# EAGLE design beagle_boy (EAGLE 5.10)

## Sheet 1 of 2
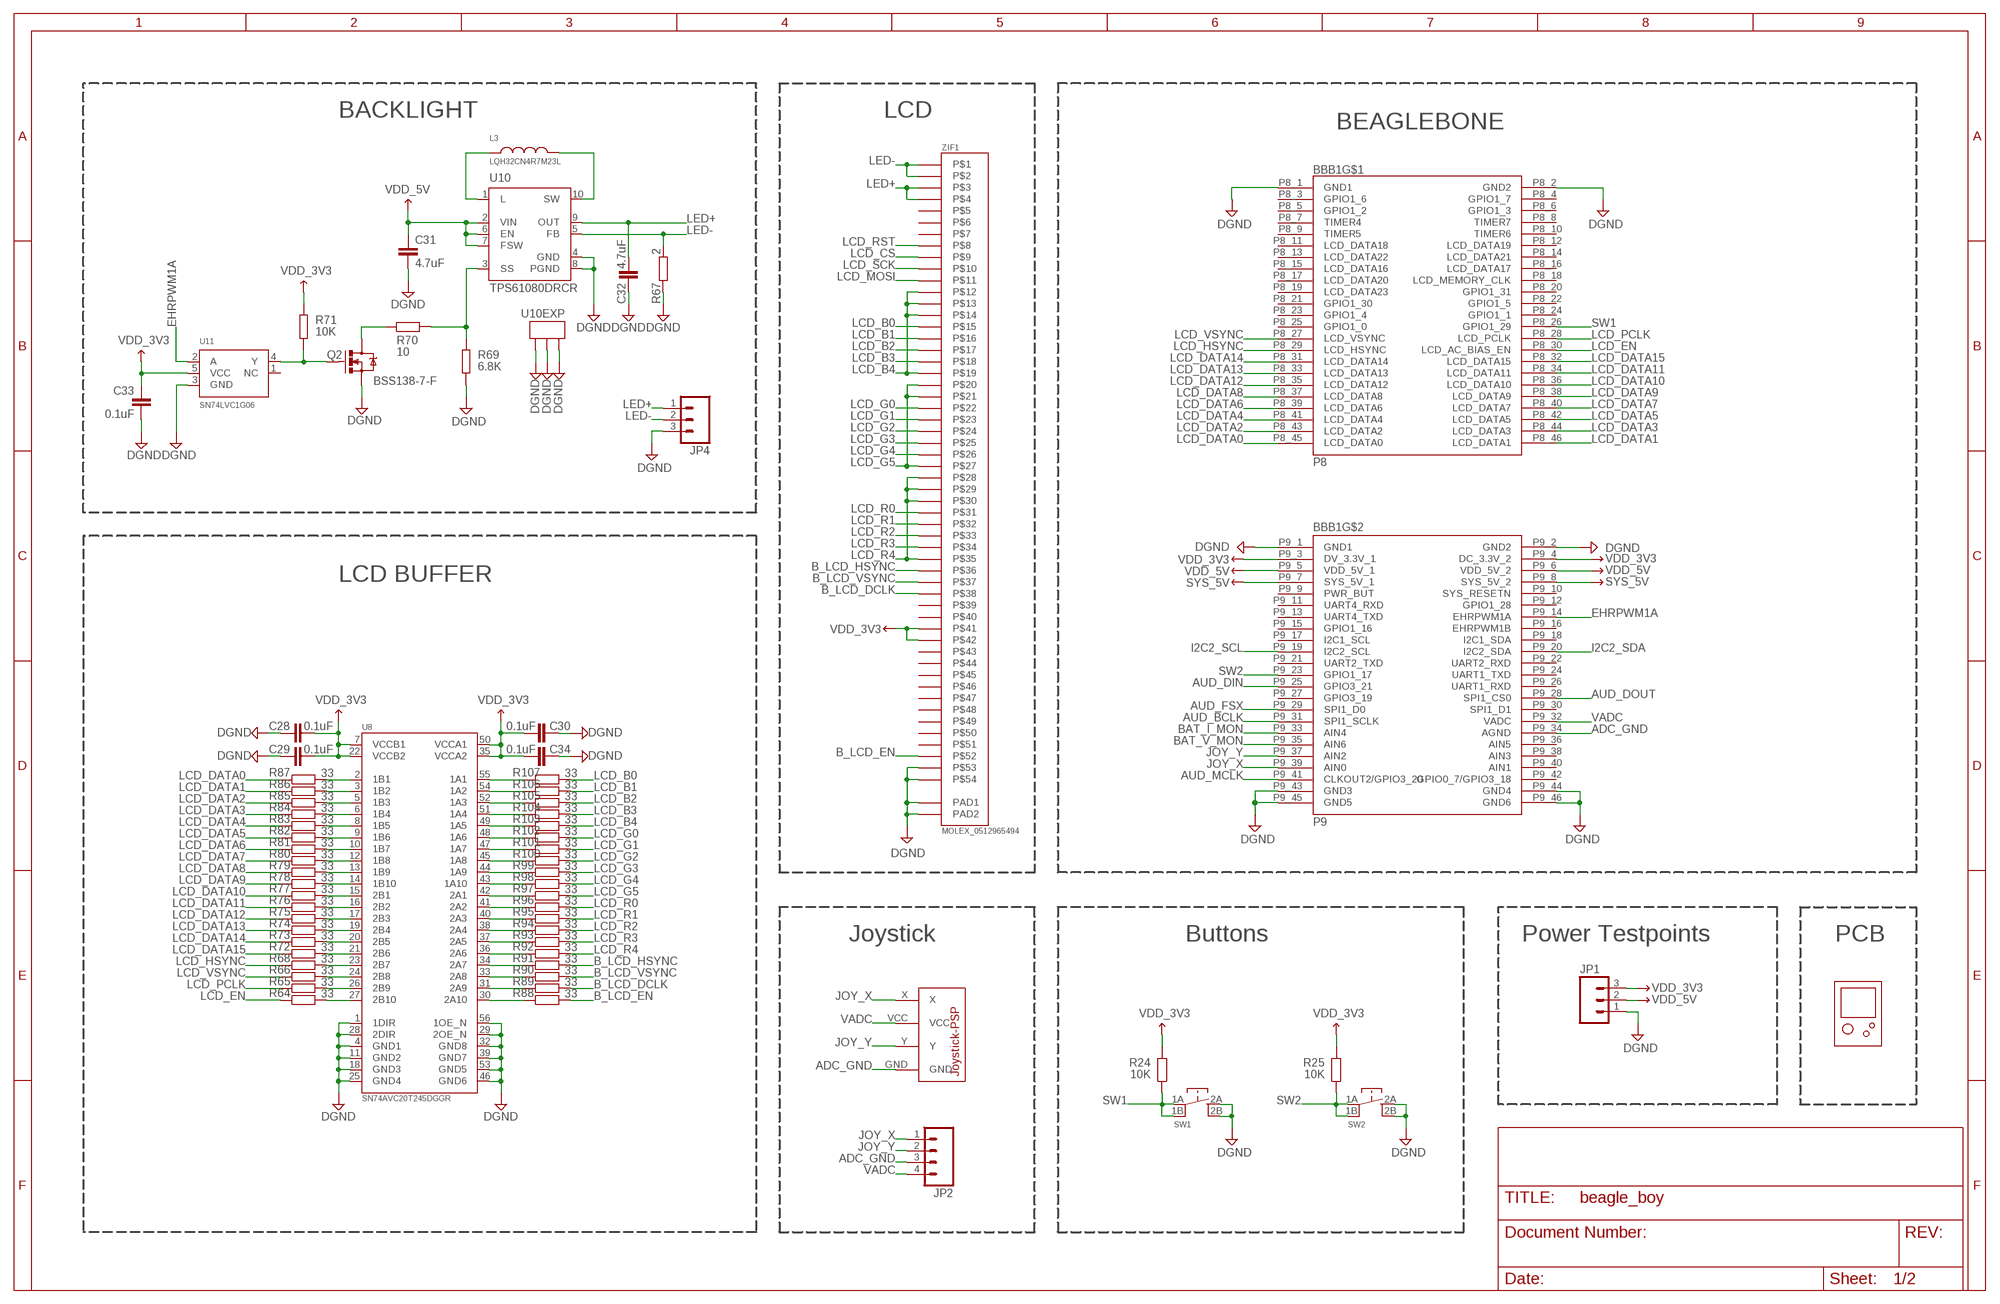
[diagram p0: schematic, sheet 1]

### Parts
BBB1  BEAGLEBONE_BLACK  [BEAGLEBOARD_BLACK]
BOARD  BEAGLE_BOY  [BEAGLE_BOY]
C28  0.1uF  C-EUC0603  [C0603]
C29  0.1uF  C-EUC0603  [C0603]
C30  0.1uF  C-EUC0603  [C0603]
C31  4.7uF  C-EUC0603  [C0603]
C32  4.7uF  C-EUC0603  [C0603]
C33  0.1uF  C-EUC0603  [C0603]
C34  0.1uF  C-EUC0603  [C0603]
JP1  M031X03_NO_SILK  [1X03_NO_SILK]
JP2  M041X04_NO_SILK  [1X04_NO_SILK]
JP4  M031X03_NO_SILK  [1X03_NO_SILK]
L3  LQH32CN4R7M23L  [LQH32C_23]
Q2  BSS138-7-F  MOSFET-NCHANNELSMD  [SOT23-3]
R24  10K  R-EU_R0603  [R0603]
R25  10K  R-EU_R0603  [R0603]
R64  33  R-EU_R0402  [R0402]
R65  33  R-EU_R0402  [R0402]
R66  33  R-EU_R0402  [R0402]
R67  2  R-EU_R0603  [R0603]
R68  33  R-EU_R0402  [R0402]
R69  6.8K  R-EU_R0603  [R0603]
R70  10  R-EU_R0603  [R0603]
R71  10K  R-EU_R0603  [R0603]
R72  33  R-EU_R0402  [R0402]
R73  33  R-EU_R0402  [R0402]
R74  33  R-EU_R0402  [R0402]
R75  33  R-EU_R0402  [R0402]
R76  33  R-EU_R0402  [R0402]
R77  33  R-EU_R0402  [R0402]
R78  33  R-EU_R0402  [R0402]
R79  33  R-EU_R0402  [R0402]
R80  33  R-EU_R0402  [R0402]
R81  33  R-EU_R0402  [R0402]
R82  33  R-EU_R0402  [R0402]
R83  33  R-EU_R0402  [R0402]
R84  33  R-EU_R0402  [R0402]
R85  33  R-EU_R0402  [R0402]
R86  33  R-EU_R0402  [R0402]
R87  33  R-EU_R0402  [R0402]
R88  33  R-EU_R0402  [R0402]
R89  33  R-EU_R0402  [R0402]
R90  33  R-EU_R0402  [R0402]
R91  33  R-EU_R0402  [R0402]
R92  33  R-EU_R0402  [R0402]
R93  33  R-EU_R0402  [R0402]
R94  33  R-EU_R0402  [R0402]
R95  33  R-EU_R0402  [R0402]
R96  33  R-EU_R0402  [R0402]
R97  33  R-EU_R0402  [R0402]
R98  33  R-EU_R0402  [R0402]
R99  33  R-EU_R0402  [R0402]
R100  33  R-EU_R0402  [R0402]
R101  33  R-EU_R0402  [R0402]
R102  33  R-EU_R0402  [R0402]
R103  33  R-EU_R0402  [R0402]
R104  33  R-EU_R0402  [R0402]
R105  33  R-EU_R0402  [R0402]
R106  33  R-EU_R0402  [R0402]
R107  33  R-EU_R0402  [R0402]
SW1  KSA0M  [KSA0M]
SW2  KSA0M  [KSA0M]
U8  SN74AVC20T245DGGR  [56-TSSOP]
U10  TPS61080DRCR  TPS61080  [S-PDSO-N10]
U11  SN74LVC1G06  SN74LVC1G06DBVR  [SOT23-5]
U$1  JOYSTICK-PSP1000  [JOYSTICK-PSP1000]
ZIF1  MOLEX_0512965494  [51296-5494]

### Nets
ADC_GND: BBB1.P9_34(AGND) JP2.3 U$1.GND
AUD_BCLK: BBB1.P9_31(SPI1_SCLK) ; also sheet 2
AUD_DIN: BBB1.P9_25(GPIO3_21) ; also sheet 2
AUD_DOUT: BBB1.P9_28(SPI1_CS0) ; also sheet 2
AUD_FSX: BBB1.P9_29(SPI1_D0) ; also sheet 2
AUD_MCLK: BBB1.P9_41(CLKOUT2/GPIO3_20) ; also sheet 2
B_LCD_DCLK: R89.2 ZIF1.P$38
B_LCD_EN: R88.2 ZIF1.P$52
B_LCD_HSYNC: R91.2 ZIF1.P$36
B_LCD_VSYNC: R90.2 ZIF1.P$37
BAT_I_MON: BBB1.P9_33(AIN4) ; also sheet 2
BAT_V_MON: BBB1.P9_35(AIN6) ; also sheet 2
DGND: BBB1.P8_1(GND1) BBB1.P8_2(GND2) BBB1.P9_1(GND1) BBB1.P9_2(GND2) BBB1.P9_43(GND3) BBB1.P9_44(GND4) BBB1.P9_45(GND5) BBB1.P9_46(GND6) C28.1 C29.1 C30.1 C31.2 C32.2 C33.2 C34.1 JP1.1 JP4.3 Q2.2(S) R67.1 R69.1 SW1.2A SW1.2B SW2.2A SW2.2B U8.1(1DIR) U8.4(GND1) U8.11(GND2) U8.18(GND3) U8.25(GND4) U8.28(2DIR) U8.29(2OE_N) U8.32(GND8) U8.39(GND7) U8.46(GND6) U8.53(GND5) U8.56(1OE_N) U10.4(GND) U10.8(PGND) U10.PP(EXP) U10.PP@1(EXP) U10.PP@2(EXP) U11.3(GND) ZIF1.P$53 ZIF1.P$54 ZIF1.PAD1 ZIF1.PAD2 ; also sheet 2
EHRPWM1A: BBB1.P9_14(EHRPWM1A) U11.2(A)
I2C2_SCL: BBB1.P9_19(I2C2_SCL) ; also sheet 2
I2C2_SDA: BBB1.P9_20(I2C2_SDA) ; also sheet 2
JOY_X: BBB1.P9_39(AIN0) JP2.1 U$1.X
JOY_Y: BBB1.P9_37(AIN2) JP2.2 U$1.Y
LCD_B0: R107.2 ZIF1.P$15
LCD_B1: R106.2 ZIF1.P$16
LCD_B2: R105.2 ZIF1.P$17
LCD_B3: R104.2 ZIF1.P$18
LCD_B4: R103.2 ZIF1.P$12 ZIF1.P$13 ZIF1.P$14 ZIF1.P$19
LCD_CS: ZIF1.P$9
LCD_DATA0: BBB1.P8_45(LCD_DATA0) R87.1
LCD_DATA1: BBB1.P8_46(LCD_DATA1) R86.1
LCD_DATA2: BBB1.P8_43(LCD_DATA2) R85.1
LCD_DATA3: BBB1.P8_44(LCD_DATA3) R84.1
LCD_DATA4: BBB1.P8_41(LCD_DATA4) R83.1
LCD_DATA5: BBB1.P8_42(LCD_DATA5) R82.1
LCD_DATA6: BBB1.P8_39(LCD_DATA6) R81.1
LCD_DATA7: BBB1.P8_40(LCD_DATA7) R80.1
LCD_DATA8: BBB1.P8_37(LCD_DATA8) R79.1
LCD_DATA9: BBB1.P8_38(LCD_DATA9) R78.1
LCD_DATA10: BBB1.P8_36(LCD_DATA10) R77.1
LCD_DATA11: BBB1.P8_34(LCD_DATA11) R76.1
LCD_DATA12: BBB1.P8_35(LCD_DATA12) R75.1
LCD_DATA13: BBB1.P8_33(LCD_DATA13) R74.1
LCD_DATA14: BBB1.P8_31(LCD_DATA14) R73.1
LCD_DATA15: BBB1.P8_32(LCD_DATA15) R72.1
LCD_EN: BBB1.P8_30(LCD_AC_BIAS_EN) R64.1
LCD_G0: R102.2 ZIF1.P$22
LCD_G1: R101.2 ZIF1.P$23
LCD_G2: R100.2 ZIF1.P$24
LCD_G3: R99.2 ZIF1.P$25
LCD_G4: R98.2 ZIF1.P$26
LCD_G5: R97.2 ZIF1.P$20 ZIF1.P$21 ZIF1.P$27
LCD_HSYNC: BBB1.P8_29(LCD_HSYNC) R68.1
LCD_MOSI: ZIF1.P$11
LCD_PCLK: BBB1.P8_28(LCD_PCLK) R65.1
LCD_R0: R96.2 ZIF1.P$31
LCD_R1: R95.2 ZIF1.P$32
LCD_R2: R94.2 ZIF1.P$33
LCD_R3: R93.2 ZIF1.P$34
LCD_R4: R92.2 ZIF1.P$28 ZIF1.P$29 ZIF1.P$30 ZIF1.P$35
LCD_RST: ZIF1.P$8
LCD_SCK: ZIF1.P$10
LCD_VSYNC: BBB1.P8_27(LCD_VSYNC) R66.1
LED+: C32.1 JP4.1 U10.9(OUT) ZIF1.P$3 ZIF1.P$4
LED-: JP4.2 R67.2 U10.5(FB) ZIF1.P$1 ZIF1.P$2
N$4: R64.2 U8.27(2B10)
N$17: R65.2 U8.26(2B9)
N$21: R66.2 U8.24(2B8)
N$29: R68.2 U8.23(2B7)
N$30: R72.2 U8.21(2B6)
N$31: R73.2 U8.20(2B5)
N$32: R74.2 U8.19(2B4)
N$33: R75.2 U8.17(2B3)
N$34: R76.2 U8.16(2B2)
N$35: R77.2 U8.15(2B1)
N$36: R107.1 U8.55(1A1)
N$37: R106.1 U8.54(1A2)
N$38: R105.1 U8.52(1A3)
N$39: R104.1 U8.51(1A4)
N$40: R103.1 U8.49(1A5)
N$41: R102.1 U8.48(1A6)
N$42: R94.1 U8.38(2A4)
N$43: R100.1 U8.45(1A8)
N$44: R99.1 U8.44(1A9)
N$45: R98.1 U8.43(1A10)
N$46: R101.1 U8.47(1A7)
N$103: R86.2 U8.3(1B2)
N$104: R85.2 U8.5(1B3)
N$105: R84.2 U8.6(1B4)
N$107: L3.P$1 U10.1(L)
N$108: L3.P$2 U10.10(SW)
N$109: R69.2 R70.2 U10.3(SS)
N$110: Q2.3(D) R70.1
N$111: Q2.1(G) R71.1 U11.4(Y)
N$117: R78.2 U8.14(1B10)
N$118: R79.2 U8.13(1B9)
N$119: R80.2 U8.12(1B8)
N$120: R81.2 U8.10(1B7)
N$121: R82.2 U8.9(1B6)
N$122: R83.2 U8.8(1B5)
N$126: R87.2 U8.2(1B1)
N$149: R90.1 U8.33(2A8)
N$151: R92.1 U8.36(2A6)
N$157: R97.1 U8.42(2A1)
N$158: R96.1 U8.41(2A2)
N$159: R95.1 U8.40(2A3)
N$161: R93.1 U8.37(2A5)
N$163: R91.1 U8.34(2A7)
N$165: R89.1 U8.31(2A9)
N$166: R88.1 U8.30(2A10)
SW1: BBB1.P8_26(GPIO1_29) R24.1 SW1.1A SW1.1B
SW2: BBB1.P9_23(GPIO1_17) R25.1 SW2.1A SW2.1B
SYS_5V: BBB1.P9_7(SYS_5V_1) BBB1.P9_8(SYS_5V_2)
VADC: BBB1.P9_32(VADC) JP2.4 U$1.VCC
VDD_3V3: BBB1.P9_3(DV_3.3V_1) BBB1.P9_4(DC_3.3V_2) C28.2 C29.2 C30.2 C33.1 C34.2 JP1.3 R24.2 R25.2 R71.2 U8.7(VCCB1) U8.22(VCCB2) U8.35(VCCA2) U8.50(VCCA1) U11.5(VCC) ZIF1.P$41 ZIF1.P$42 ; also sheet 2
VDD_5V: BBB1.P9_5(VDD_5V_1) BBB1.P9_6(VDD_5V_2) C31.1 JP1.2 U10.2(VIN) U10.6(EN) U10.7(FSW) ; also sheet 2
Unconnected: BBB1.P8_3(GPIO1_6) BBB1.P8_4(GPIO1_7) BBB1.P8_5(GPIO1_2) BBB1.P8_6(GPIO1_3) BBB1.P8_7(TIMER4) BBB1.P8_8(TIMER7) BBB1.P8_9(TIMER5) BBB1.P8_10(TIMER6) BBB1.P8_11(LCD_DATA18) BBB1.P8_12(LCD_DATA19) BBB1.P8_13(LCD_DATA22) BBB1.P8_14(LCD_DATA21) BBB1.P8_15(LCD_DATA16) BBB1.P8_16(LCD_DATA17) BBB1.P8_17(LCD_DATA20) BBB1.P8_18(LCD_MEMORY_CLK) BBB1.P8_19(LCD_DATA23) BBB1.P8_20(GPIO1_31) BBB1.P8_21(GPIO1_30) BBB1.P8_22(GPIO1_5) BBB1.P8_23(GPIO1_4) BBB1.P8_24(GPIO1_1) BBB1.P8_25(GPIO1_0) BBB1.P9_9(PWR_BUT) BBB1.P9_10(SYS_RESETN) BBB1.P9_11(UART4_RXD) BBB1.P9_12(GPIO1_28) BBB1.P9_13(UART4_TXD) BBB1.P9_15(GPIO1_16) BBB1.P9_16(EHRPWM1B) BBB1.P9_17(I2C1_SCL) BBB1.P9_18(I2C1_SDA) BBB1.P9_21(UART2_TXD) BBB1.P9_22(UART2_RXD) BBB1.P9_24(UART1_TXD) BBB1.P9_26(UART1_RXD) BBB1.P9_27(GPIO3_19) BBB1.P9_30(SPI1_D1) BBB1.P9_36(AIN5) BBB1.P9_38(AIN3) BBB1.P9_40(AIN1) BBB1.P9_42(GPIO0_7/GPIO3_18) U11.1(NC) ZIF1.P$5 ZIF1.P$6 ZIF1.P$7 ZIF1.P$39 ZIF1.P$40 ZIF1.P$43 ZIF1.P$44 ZIF1.P$45 ZIF1.P$46 ZIF1.P$47 ZIF1.P$48 ZIF1.P$49 ZIF1.P$50 ZIF1.P$51

### Notes on the sheet
- BACKLIGHT | LCD
- BEAGLEBONE
- LCD BUFFER
- Joystick | Buttons | Power Testpoints | PCB

## Sheet 2 of 2
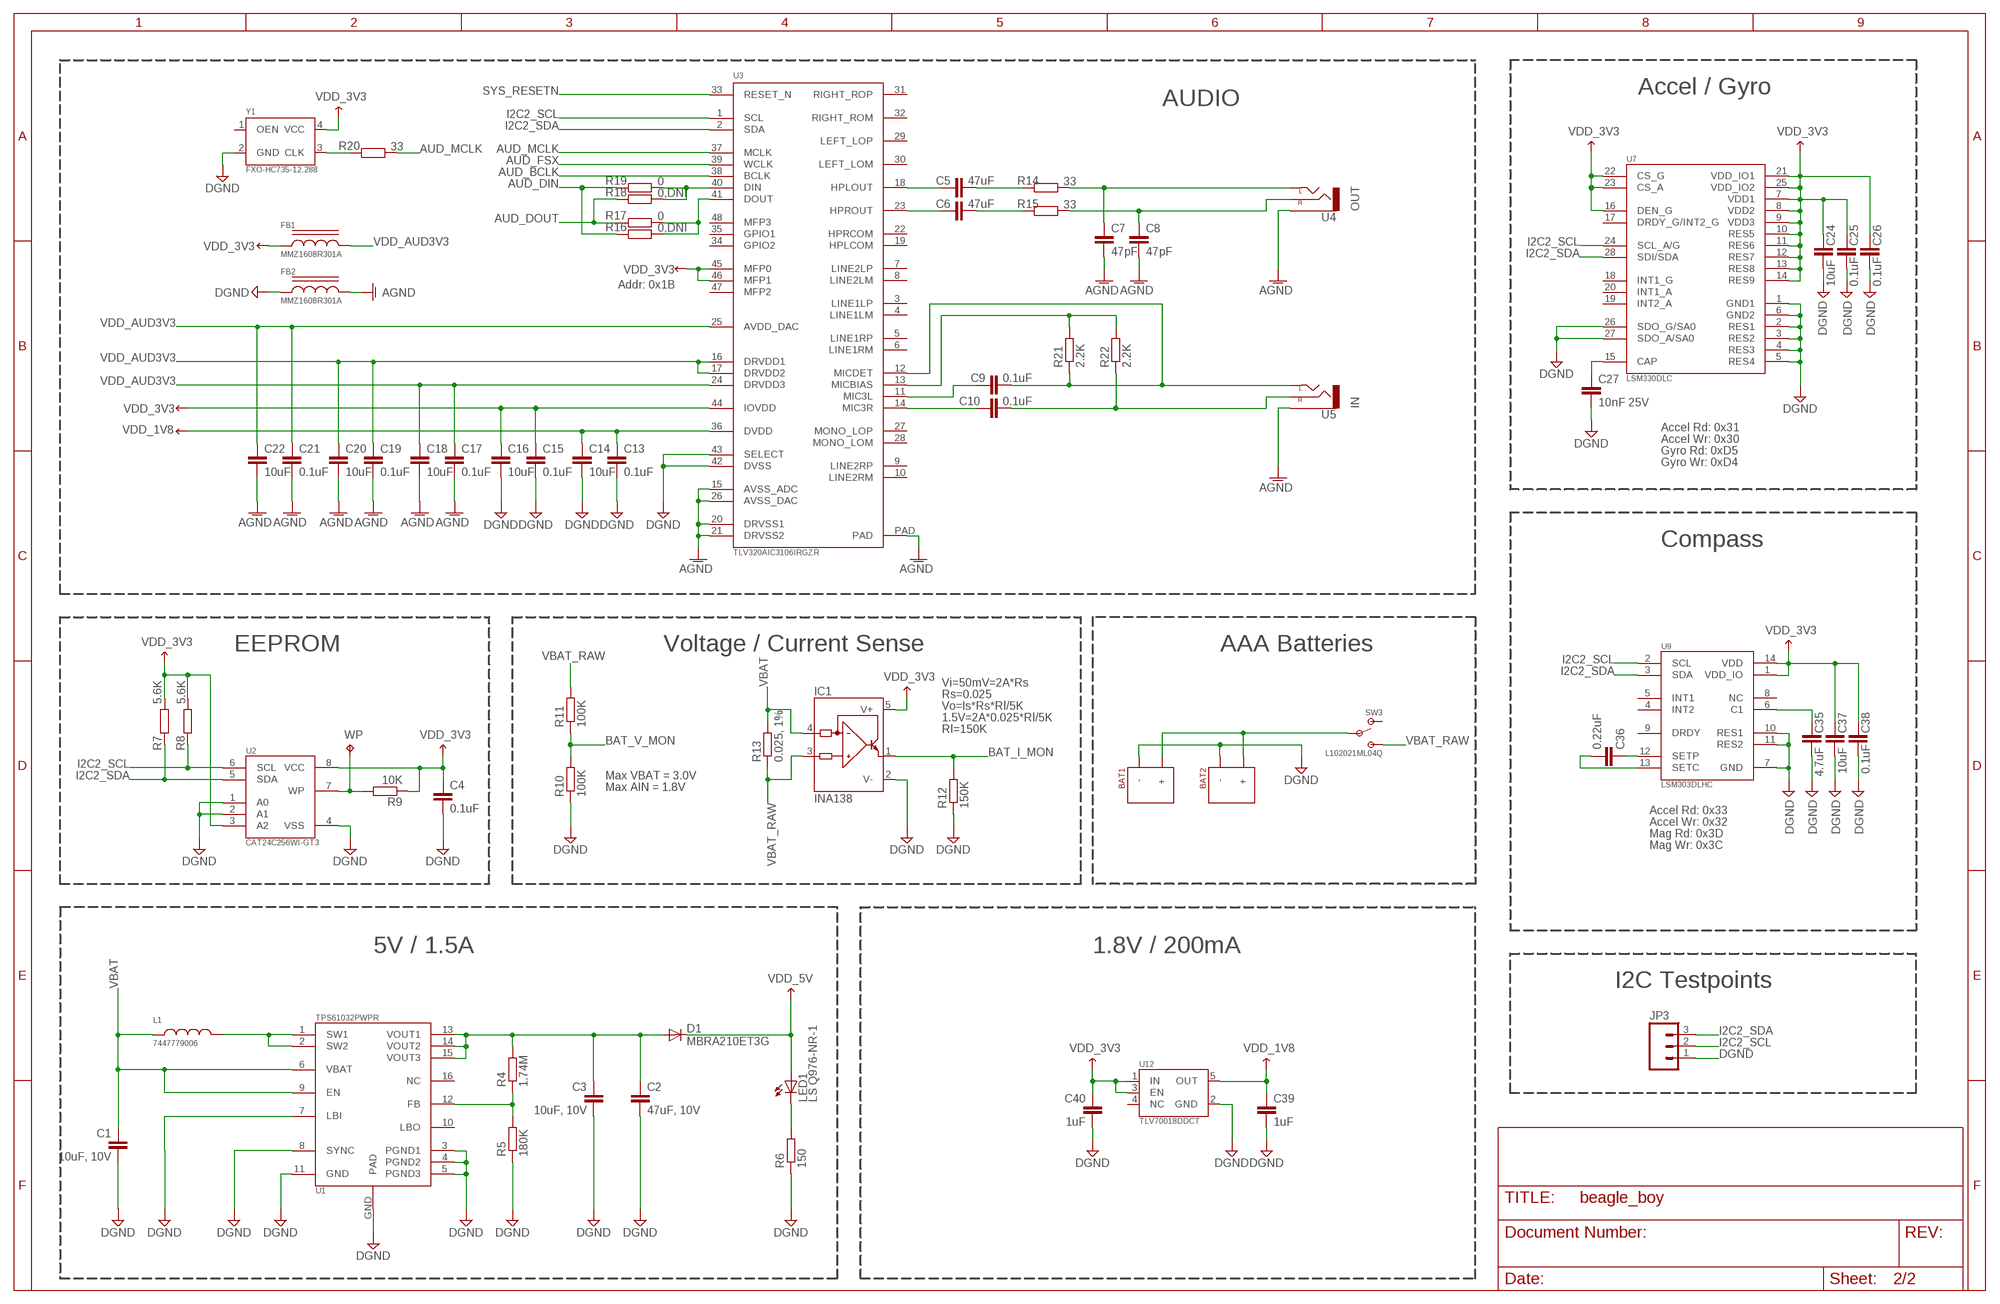
[diagram p1: schematic, sheet 2]

### Parts
BAT1  2_CELL_AAA  [2_CELL_AAA]
BAT2  2_CELL_AAA  [2_CELL_AAA]
C1  10uF, 10V  C-EUC0805K  [C0805K]
C2  47uF, 10V  C-EUC1206  [C1206]
C3  10uF, 10V  C-EUC0805K  [C0805K]
C4  0.1uF  C-EUC0603  [C0603]
C5  47uF  C-EUC1210  [C1210]
C6  47uF  C-EUC1210  [C1210]
C7  47pF  C-EUC0603  [C0603]
C8  47pF  C-EUC0603  [C0603]
C9  0.1uF  C-EUC0603  [C0603]
C10  0.1uF  C-EUC0603  [C0603]
C13  0.1uF  C-EUC0603  [C0603]
C14  10uF  C-EUC0603  [C0603]
C15  0.1uF  C-EUC0603  [C0603]
C16  10uF  C-EUC0603  [C0603]
C17  0.1uF  C-EUC0603  [C0603]
C18  10uF  C-EUC0603  [C0603]
C19  0.1uF  C-EUC0603  [C0603]
C20  10uF  C-EUC0603  [C0603]
C21  0.1uF  C-EUC0603  [C0603]
C22  10uF  C-EUC0603  [C0603]
C24  10uF  C-EUC0603  [C0603]
C25  0.1uF  C-EUC0603  [C0603]
C26  0.1uF  C-EUC0603  [C0603]
C27  10nF 25V  C-EUC0603  [C0603]
C35  4.7uF  C-EUC0603  [C0603]
C36  0.22uF  C-EUC0603  [C0603]
C37  10uF  C-EUC0603  [C0603]
C38  0.1uF  C-EUC0603  [C0603]
C39  1uF  C-EUC0603  [C0603]
C40  1uF  C-EUC0603  [C0603]
D1  MBRA210ET3G  DIODESMA-ALT  [SMA-DIODE_ALT]
FB1  MMZ1608R301A  [R0603]
FB2  MMZ1608R301A  [R0603]
IC1  INA138  [SOT23-5]
JP3  M031X03_NO_SILK  [1X03_NO_SILK]
L1  7447779006  [7447779006]
LED1  LS Q976-NR-1  LED0603  [LED-0603]
R4  1.74M  R-EU_R0603  [R0603]
R5  180K  R-EU_R0603  [R0603]
R6  150  R-EU_R0603  [R0603]
R7  5.6K  R-EU_R0603  [R0603]
R8  5.6K  R-EU_R0603  [R0603]
R9  10K  R-EU_R0603  [R0603]
R10  100K  R-EU_R0805  [R0805]
R11  100K  R-EU_R0805  [R0805]
R12  150K  R-EU_R0805  [R0805]
R13  0.025, 1%  R-EU_R1206  [R1206]
R14  33  R-EU_R0603  [R0603]
R15  33  R-EU_R0603  [R0603]
R16  0,DNI  R-EU_R0603  [R0603]
R17  0  R-EU_R0603  [R0603]
R18  0,DNI  R-EU_R0603  [R0603]
R19  0  R-EU_R0603  [R0603]
R20  33  R-EU_R0603  [R0603]
R21  2.2K  R-EU_R0603  [R0603]
R22  2.2K  R-EU_R0603  [R0603]
SW3  L102021ML04Q  [L102021ML04Q]
U1  TPS61032PWPR  [HTSSOP16PWP]
U2  CAT24C256WI-GT3  [SO-08]
U3  TLV320AIC3106IRGZR  [48-VFQFN]
U4  AUDIO-JACKSMD2  [AUDIO-JACK-3.5MM-SMD]
U5  AUDIO-JACKSMD2  [AUDIO-JACK-3.5MM-SMD]
U7  LSM330DLC  LSM330DLCTR  [LGA28-4X5]
U9  LSM303DLHC  LSM303DLHCTR  [LGA14]
U12  TLV70018DDCT  [SOT23-5]
WP  TPPAD1-13  [P1-13]
Y1  FXO-HC735-12.288  [FXO-HC735-12.288]

### Nets
AGND: C7.2 C8.2 C17.2 C18.2 C19.2 C20.2 C21.2 C22.2 FB2.2 U3.15(AVSS_ADC) U3.20(DRVSS1) U3.21(DRVSS2) U3.26(AVSS_DAC) U3.PAD U4.SLEEVE U5.SLEEVE
AUD_BCLK: U3.38(BCLK) ; also sheet 1
AUD_DIN: R16.1 R19.1 ; also sheet 1
AUD_DOUT: R17.1 R18.1 ; also sheet 1
AUD_FSX: U3.39(WCLK) ; also sheet 1
AUD_MCLK: R20.2 U3.37(MCLK) ; also sheet 1
BAT_I_MON: IC1.1(OUT) R12.2 ; also sheet 1
BAT_V_MON: R10.2 R11.1 ; also sheet 1
DGND: BAT1.- BAT2.- C1.2 C2.2 C3.2 C4.2 C13.2 C14.2 C15.2 C16.2 C24.2 C25.2 C26.2 C27.2 C35.2 C37.2 C38.2 C39.2 C40.2 FB2.1 IC1.2(V-) JP3.1 R5.1 R6.1 R10.1 R12.1 U1.3(PGND1) U1.4(PGND2) U1.5(PGND3) U1.7(LBI) U1.8(SYNC) U1.11(GND) U1.GND(PAD) U2.1(A0) U2.2(A1) U2.4(VSS) U3.42(DVSS) U3.43(SELECT) U7.1(GND1) U7.2(RES1) U7.3(RES2) U7.4(RES3) U7.5(RES4) U7.6(GND2) U7.26(SDO_G/SA0) U7.27(SDO_A/SA0) U9.7(GND) U9.10(RES1) U9.11(RES2) U12.2(GND) Y1.2(GND) ; also sheet 1
I2C2_SCL: JP3.2 R8.1 U2.6(SCL) U3.1(SCL) U7.24(SCL_A/G) U9.2(SCL) ; also sheet 1
I2C2_SDA: JP3.3 R7.1 U2.5(SDA) U3.2(SDA) U7.28(SDI/SDA) U9.3(SDA) ; also sheet 1
N$1: L1.P$2 U1.1(SW1) U1.2(SW2)
N$2: R9.2 U2.7(WP) WP.TP
N$5: R4.1 R5.2 U1.12(FB)
N$6: C2.1 C3.1 D1.A R4.2 U1.13(VOUT1) U1.14(VOUT2) U1.15(VOUT3)
N$7: LED1.C R6.2
N$8: C5.1 U3.18(HPLOUT)
N$9: C6.1 U3.23(HPROUT)
N$10: C5.2 R14.1
N$11: C6.2 R15.1
N$12: C7.1 R14.2 U4.TIP(LEFT)
N$13: C8.1 R15.2 U4.RING(RIGHT)
N$14: C27.1 U7.15(CAP)
N$15: C36.1 U9.12(SETP)
N$16: C36.2 U9.13(SETC)
N$18: C10.2 R22.1 U5.RING(RIGHT)
N$19: R16.2 R17.2 U3.41(DOUT)
N$20: R18.2 R19.2 U3.40(DIN)
N$22: C35.1 U9.6(C1)
N$23: C9.1 U3.11(MIC3L)
N$24: C10.1 U3.14(MIC3R)
N$25: R20.1 Y1.3(CLK)
N$26: BAT1.+ BAT2.+ SW3.2
N$27: R21.2 R22.2 U3.13(MICBIAS)
N$28: C9.2 R21.1 U3.12(MICDET) U5.TIP(LEFT)
SYS_RESETN: U3.33(RESET_N)
VBAT: C1.1 IC1.4(IN-) L1.P$1 R13.2 U1.6(VBAT) U1.9(EN)
VBAT_RAW: IC1.3(IN+) R11.2 R13.1 SW3.1
VDD_1V8: C13.1 C14.1 C39.1 U3.36(DVDD) U12.5(OUT)
VDD_3V3: C4.1 C15.1 C16.1 C24.1 C25.1 C26.1 C37.1 C38.1 C40.1 FB1.1 IC1.5(V+) R7.2 R8.2 R9.1 U2.3(A2) U2.8(VCC) U3.44(IOVDD) U3.45(MFP0) U3.46(MFP1) U7.7(VDD1) U7.8(VDD2) U7.9(VDD3) U7.10(RES5) U7.11(RES6) U7.12(RES7) U7.13(RES8) U7.14(RES9) U7.16(DEN_G) U7.21(VDD_IO1) U7.22(CS_G) U7.23(CS_A) U7.25(VDD_IO2) U9.1(VDD_IO) U9.14(VDD) U12.1(IN) U12.3(EN) Y1.4(VCC) ; also sheet 1
VDD_5V: D1.C LED1.A ; also sheet 1
VDD_AUD3V3: C17.1 C18.1 C19.1 C20.1 C21.1 C22.1 FB1.2 U3.16(DRVDD1) U3.17(DRVDD2) U3.24(DRVDD3) U3.25(AVDD_DAC)
Unconnected: SW3.3 U1.10(LBO) U1.16(NC) U3.3(LINE1LP) U3.4(LINE1LM) U3.5(LINE1RP) U3.6(LINE1RM) U3.7(LINE2LP) U3.8(LINE2LM) U3.9(LINE2RP) U3.10(LINE2RM) U3.19(HPLCOM) U3.22(HPRCOM) U3.27(MONO_LOP) U3.28(MONO_LOM) U3.29(LEFT_LOP) U3.30(LEFT_LOM) U3.31(RIGHT_ROP) U3.32(RIGHT_ROM) U3.34(GPIO2) U3.35(GPIO1) U3.47(MFP2) U3.48(MFP3) U7.17(DRDY_G/INT2_G) U7.18(INT1_G) U7.19(INT2_A) U7.20(INT1_A) U9.4(INT2) U9.5(INT1) U9.8(NC) U9.9(DRDY) U12.4(NC) Y1.1(OEN)

### Notes on the sheet
- Accel / Gyro
- AUDIO
- OUT
- Addr: 0x1B
- IN
- Accel Rd: 0x31
- Accel Wr: 0x30
- Gyro Rd: 0xD5
- Gyro Wr: 0xD4
- Compass
- EEPROM | Voltage / Current Sense | AAA Batteries
- Vi=50mV=2A*Rs
- Rs=0.025
- Vo=Is*Rs*Rl/5K
- 1.5V=2A*0.025*Rl/5K
- Rl=150K
- Max VBAT = 3.0V
- Max AIN = 1.8V
- Accel Rd: 0x33
- Accel Wr: 0x32
- Mag Rd: 0x3D
- Mag Wr: 0x3C
- 5V / 1.5A | 1.8V / 200mA
- I2C Testpoints

## Library data of the parts
BAT1 BAT2 = 2_CELL_AAA:2_CELL_AAA
BBB1 = beaglebone:BEAGLEBONE_BLACK
BOARD = board:BEAGLE_BOY
C1-C10 C13-C22 C24-C40 = rcl:C-EU: CAPACITOR, European symbol
D1 = SparkFun:DIODE: Diode These are standard reverse protection diodes and small signal diodes. SMA package can handle up to about 1A. SOD-323 can handle about 200mA. What the SOD-323 package when ordering, there are some mfgs out there that are 5-pin packages.
FB1 FB2 = Ferrite_MMZ1608R301A:MMZ1608R301A
IC1 = burr-brown:INA138: High-Side Measurement Current Shunt Monitor
JP1 JP3 JP4 = SparkFun:M03: Header 3 Standard 3-pin 0.1" header. Use with straight break away headers (SKU : PRT-00116), right angle break away headers (PRT-00553), swiss pins (PRT-00743), machine pins (PRT-00117), and female headers (PRT-00115). Molex polarized connector foot print use with SKU : PRT-08232 with associated crimp pins and housings.
JP2 = SparkFun:M04: Header 4 Standard 4-pin 0.1" header. Use with straight break away headers (SKU : PRT-00116), right angle break away headers (PRT-00553), swiss pins (PRT-00743), machine pins (PRT-00117), and female headers (PRT-00115). Molex polarized connector foot print use with SKU : PRT-08231 with associated crimp pins and housings. 1MM SMD Version SKU: PRT-10208
L1 = IND_7447779006:7447779006
L3 = LQH32CN4R7M23L:LQH32CN4R7M23L
LED1 = SparkFun:LED: LEDs Standard schematic elements and footprints for 5mm, 3mm, 1206, and 0603 sized LEDs. 5mm - Spark Fun Electronics SKU : COM-00529 (and others)
Q2 = SparkFun:MOSFET-NCHANNEL
R4-R22 R24 R25 R64-R107 = resistor:R-EU_: RESISTOR, European symbol
SW1 SW2 = KSA_switch:KSA0M
SW3 = SW_L102021ML04Q:L102021ML04Q
U1 = TPS61032:TPS61032PWPR
U2 = CAT24C256WI-GT3:CAT24C256WI-GT3
U3 = TLV320AIC3106:TLV320AIC3106IRGZR
U4 U5 = SparkFun:AUDIO-JACK: 3.5mm Audio Jack Simple 3.5mm common PCB mount audio jack. SKU: PRT-08032
U7 = LSM330:LSM330DLCTR
U8 = SN74AVC20T245:SN74AVC20T245DGGR
U9 = LSM303:LSM303DLHCTR
U10 = TPS61080:TPS6108*: HIGH VOLTAGE DC/DC BOOST CONVERTER WITH 0.5-A/1.3-A INTEGRATED SWITCH Source: www.ti.com .. tps61081[1].pdf
U11 = SN74LVC1G06:SN74LVC1G06DBVR
U12 = TLV70025:TLV70018DDCT
U$1 = SparkFun:JOYSTICK-PSP1000: This is a footprint for the PSP-1000 Joystick. 4-pins: X, Y, Vcc and GND
WP = testpad:TP: Test pad
Y1 = FXO-HC735:FXO-HC735-12.288
ZIF1 = molex_0512965494:MOLEX_0512965494

## Board
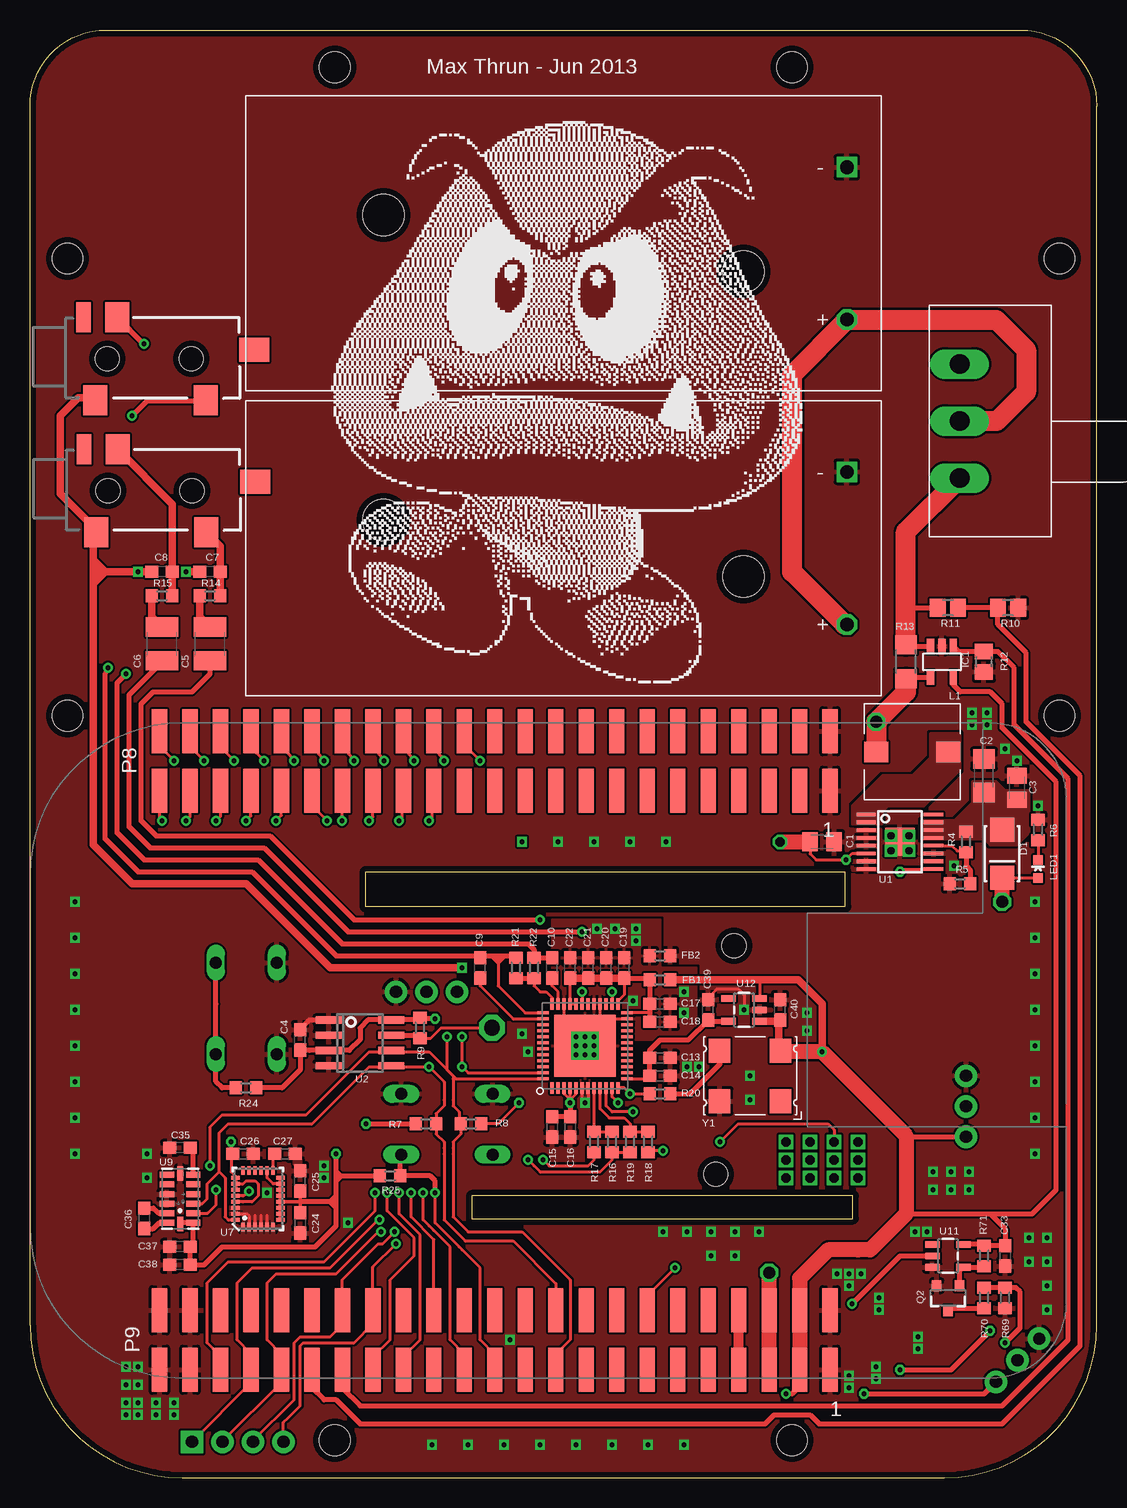
[diagram p2: board, top side]
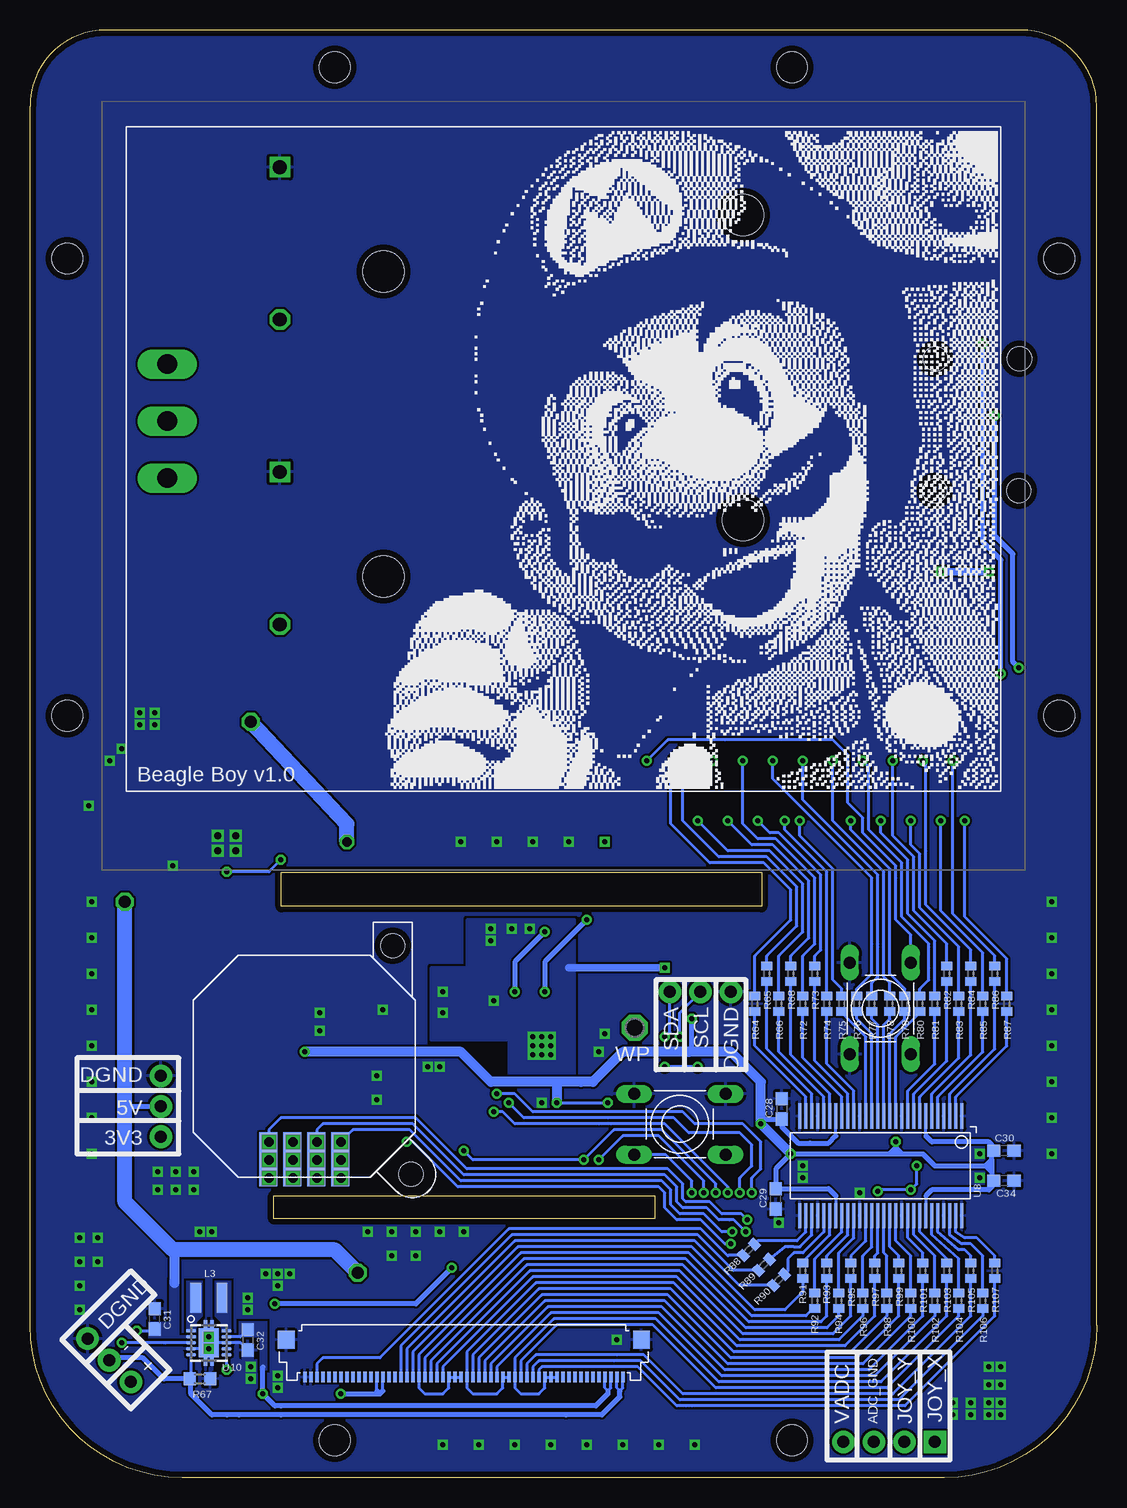
[diagram p3: board, bottom side, seen from below]

Size 88.9 x 120.65 mm. Coordinates in mm from the lower left corner, seen from the top.
Copper layers (1*16): Top 0.0356mm / dielectric 1.5011mm / Bottom 0.0356mm
Design rules "SilverCircuits_tented": minimum track width 7mil, minimum drill 14mil, track to track 7mil, track to pad 7mil, pad to pad 7mil, via to via 7mil, smd to smd 0mil, copper to edge 20mil, drill to drill 8mil, minimum pad ring 10mil, minimum via ring 8mil, stop-mask expansion 4mil, vias tented up to drill 17mil, thermal gap 10mil

### Footprints (pad centres in the part's own frame; a part is rotated, then mirrored left to right if it is on the bottom)
2_CELL_AAA = drill 1.143 octagon: + 0,-6.35 | drill 1.143 square: - 0,6.35 | hole 3.454: -8.636,-2.349; -38.608,2.349
BEAGLEBOARD_BLACK = smd 1.27 x 3.683 bottom: P8_1 19.685,48.959; P8_2 19.685,53.911; P8_3 22.225,48.959; P8_4 22.225,53.911; P8_5 24.765,48.959; P8_6 24.765,53.911; P8_7 27.305,48.959; P8_8 27.305,53.911; P8_9 29.845,48.959; P8_10 29.845,53.911; P8_11 32.385,48.959; P8_12 32.385,53.911; P8_13 34.925,48.959; P8_14 34.925,53.911; P8_15 37.465,48.959; P8_16 37.465,53.911; P8_17 40.005,48.959; P8_18 40.005,53.911; P8_19 42.545,48.959; P8_20 42.545,53.911; P8_21 45.085,48.959; P8_22 45.085,53.911; P8_23 47.625,48.959; P8_24 47.625,53.911; P8_25 50.165,48.959; P8_26 50.165,53.911; P8_27 52.705,48.959; P8_28 52.705,53.911; P8_29 55.245,48.959; P8_30 55.245,53.911; P8_31 57.785,48.959; P8_32 57.785,53.911; P8_33 60.325,48.959; P8_34 60.325,53.911; P8_35 62.865,48.959; P8_36 62.865,53.911; P8_37 65.405,48.959; P8_38 65.405,53.911; P8_39 67.945,48.959; P8_40 67.945,53.911; P8_41 70.485,48.959; P8_42 70.485,53.911; P8_43 73.025,48.959; P8_44 73.025,53.911; P8_45 75.565,48.959; P8_46 75.565,53.911; P9_1 19.685,0.699; P9_2 19.685,5.652; P9_3 22.225,0.699; P9_4 22.225,5.652; P9_5 24.765,0.699; P9_6 24.765,5.652; P9_7 27.305,0.699; P9_8 27.305,5.652; P9_9 29.845,0.699; P9_10 29.845,5.652; P9_11 32.385,0.699; P9_12 32.385,5.652; P9_13 34.925,0.699; P9_14 34.925,5.652; P9_15 37.465,0.699; P9_16 37.465,5.652; P9_17 40.005,0.699; P9_18 40.005,5.652; P9_19 42.545,0.699; P9_20 42.545,5.652; P9_21 45.085,0.699; P9_22 45.085,5.652; P9_23 47.625,0.699; P9_24 47.625,5.652; P9_25 50.165,0.699; P9_26 50.165,5.652; P9_27 52.705,0.699; P9_28 52.705,5.652; P9_29 55.245,0.699; P9_30 55.245,5.652; P9_31 57.785,0.699; P9_32 57.785,5.652; P9_33 60.325,0.699; P9_34 60.325,5.652; P9_35 62.865,0.699; P9_36 62.865,5.652; P9_37 65.405,0.699; P9_38 65.405,5.652; P9_39 67.945,0.699; P9_40 67.945,5.652; P9_41 70.485,0.699; P9_42 70.485,5.652; P9_43 73.025,0.699; P9_44 73.025,5.652; P9_45 75.565,0.699; P9_46 75.565,5.652
BEAGLE_BOY = hole 2.54: 25.4,3.124; 63.5,3.124; 85.801,63.5; 85.801,101.6; 63.5,117.551; 25.4,117.551; 3.124,101.6; 3.124,63.5
C0805K = smd 1.3 x 1.6: 1 -1,0; 2 1,0
C1206 = smd 1.6 x 1.8: 1 -1.4,0; 2 1.4,0
C0603 = smd 1.1 x 1: 1 -0.85,0; 2 0.85,0
C1210 = smd 1.6 x 2.7: 1 -1.4,0; 2 1.4,0
SMA-DIODE_ALT = smd 2 x 2: A -2,0; C 2,0
R0603 = smd 1 x 1.1: 1 -0.85,0; 2 0.85,0
SOT23-5 = smd 0.6 x 1.2: 1 -0.95,-1.306; 2 0,-1.306; 3 0.95,-1.306; 4 0.95,1.306; 5 -0.95,1.306
1X03_NO_SILK = drill 1.016 pad 1.88 round: 1 0,0; 2 2.54,0; 3 5.08,0
1X04_NO_SILK = drill 1.016 pad 1.88 square: 1 0,0 | drill 1.016 pad 1.88 round: 2 2.54,0; 3 5.08,0; 4 7.62,0
7447779006 = smd 1.7 x 2: P$1 0,3; P$2 0,-3
LQH32C_23 = smd 0.9 x 2.5: P$1 -1.1,0; P$2 1.1,0
LED-0603 = smd 0.8 x 0.8: A 0,-0.75; C 0,0.75
SOT23-3 = smd 0.8 x 0.9: 1 -0.95,-1; 2 0.95,-1; 3 0,1.1
R0805 = smd 1.3 x 1.5: 1 -0.85,0; 2 0.85,0
R1206 = smd 1.6 x 1.803: 1 -1.422,0; 2 1.422,0
R0402 = smd 0.7 x 0.9: 1 -0.65,0; 2 0.65,0
KSA0M = drill 1 long: 1A -3.81,-2.54; 1B 3.81,-2.54; 2A -3.81,2.54; 2B 3.81,2.54
L102021ML04Q = drill 1.651 long: 1 0,-4.75; 2 0,0; 3 0,4.75
HTSSOP16PWP = smd 0.3 x 1.6: 1 -2.275,-2.8; 2 -1.625,-2.8; 3 -0.975,-2.8; 4 -0.325,-2.8; 5 0.325,-2.8; 6 0.975,-2.8; 7 1.625,-2.8; 8 2.275,-2.8; 9 2.275,2.8; 10 1.625,2.8; 11 0.975,2.8; 12 0.325,2.8; 13 -0.325,2.8; 14 -0.975,2.8; 15 -1.625,2.8; 16 -2.275,2.8 | smd 2.31 x 2.46: GND 0,0
SO-08 = smd 0.6 x 2.2: 1 -1.905,-2.6; 2 -0.635,-2.6; 3 0.635,-2.6; 4 1.905,-2.6; 5 1.905,2.6; 6 0.635,2.6; 7 -0.635,2.6; 8 -1.905,2.6
48-VFQFN = smd 0.28 x 0.95: 1 -2.75,3.5; 2 -2.25,3.5; 3 -1.75,3.5; 4 -1.25,3.5; 5 -0.75,3.5; 6 -0.25,3.5; 7 0.25,3.5; 8 0.75,3.5; 9 1.25,3.5; 10 1.75,3.5; 11 2.25,3.5; 12 2.75,3.5; 25 2.75,-3.5; 26 2.25,-3.5; 27 1.75,-3.5; 28 1.25,-3.5; 29 0.75,-3.5; 30 0.25,-3.5; 31 -0.25,-3.5; 32 -0.75,-3.5; 33 -1.25,-3.5; 34 -1.75,-3.5; 35 -2.25,-3.5; 36 -2.75,-3.5 | smd 0.95 x 0.28: 13 3.5,2.75; 14 3.5,2.25; 15 3.5,1.75; 16 3.5,1.25; 17 3.5,0.75; 18 3.5,0.25; 19 3.5,-0.25; 20 3.5,-0.75; 21 3.5,-1.25; 22 3.5,-1.75; 23 3.5,-2.25; 24 3.5,-2.75; 37 -3.5,-2.75; 38 -3.5,-2.25; 39 -3.5,-1.75; 40 -3.5,-1.25; 41 -3.5,-0.75; 42 -3.5,-0.25; 43 -3.5,0.25; 44 -3.5,0.75; 45 -3.5,1.25; 46 -3.5,1.75; 47 -3.5,2.25; 48 -3.5,2.75 | smd 5.15 x 5.15: PAD 0,0
AUDIO-JACK-3.5MM-SMD = smd 2 x 2.5: RING 4.3,3.45; SLEEVE 2.5,-3.45; TIP 11.7,-3.45 | smd 1.2 x 2.5: RSH 1.5,3.45 | smd 2.5 x 2: TSH 15.75,0.75 | hole 2: 3.5,0; 10.5,0
LGA28-4X5 = smd 0.7 x 0.31: 1 -2.362,1.25; 2 -2.362,0.75; 3 -2.362,0.25; 4 -2.362,-0.25; 5 -2.362,-0.75; 6 -2.362,-1.25; 15 2.362,-1.25; 16 2.362,-0.75; 17 2.362,-0.25; 18 2.362,0.25; 19 2.362,0.75; 20 2.362,1.25 | smd 0.31 x 0.7: 7 -1.75,-1.863; 8 -1.25,-1.863; 9 -0.75,-1.863; 10 -0.25,-1.863; 11 0.25,-1.863; 12 0.75,-1.863; 13 1.25,-1.863; 14 1.75,-1.863; 21 1.75,1.863; 22 1.25,1.863; 23 0.75,1.863; 24 0.25,1.863; 25 -0.25,1.863; 26 -0.75,1.863; 27 -1.25,1.863; 28 -1.75,1.863
56-TSSOP = smd 0.27 x 2.1: 1 -7.5,-4.15; 2 -7,-4.15; 3 -6.5,-4.15; 4 -6,-4.15; 5 -5.5,-4.15; 6 -5,-4.15; 7 -4.5,-4.15; 8 -4,-4.15; 9 -3.5,-4.15; 10 -3,-4.15; 11 -2.5,-4.15; 12 -2,-4.15; 13 -1.5,-4.15; 14 -1,-4.15; 15 -0.5,-4.15; 16 0,-4.15; 17 0.5,-4.15; 18 1,-4.15; 19 1.5,-4.15; 20 2,-4.15; 21 2.5,-4.15; 22 3,-4.15; 23 3.5,-4.15; 24 4,-4.15; 25 4.5,-4.15; 26 5,-4.15; 27 5.5,-4.15; 28 6,-4.15; 29 6,4.15; 30 5.5,4.15; 31 5,4.15; 32 4.5,4.15; 33 4,4.15; 34 3.5,4.15; 35 3,4.15; 36 2.5,4.15; 37 2,4.15; 38 1.5,4.15; 39 1,4.15; 40 0.5,4.15; 41 0,4.15; 42 -0.5,4.15; 43 -1,4.15; 44 -1.5,4.15; 45 -2,4.15; 46 -2.5,4.15; 47 -3,4.15; 48 -3.5,4.15; 49 -4,4.15; 50 -4.5,4.15; 51 -5,4.15; 52 -5.5,4.15; 53 -6,4.15; 54 -6.5,4.15; 55 -7,4.15; 56 -7.5,4.15
LGA14 = smd 0.5 x 1.2: 1 2,1.1; 2 1.2,1.1; 3 0.4,1.1; 4 -0.4,1.1; 5 -1.2,1.1; 6 -2,1.1; 8 -2,-1.1; 9 -1.2,-1.1; 10 -0.4,-1.1; 11 0.4,-1.1; 12 1.2,-1.1; 13 2,-1.1 | smd 1.2 x 0.5: 7 -2.1,0; 14 2.1,0
S-PDSO-N10 = smd 0.28 x 0.85: 1 -1,-1.475; 2 -0.5,-1.475; 3 0,-1.475; 4 0.5,-1.475; 5 1,-1.475; 6 1,1.475; 7 0.5,1.475; 8 0,1.475; 9 -0.5,1.475; 10 -1,1.475 | smd 2.4 x 1.65: PP 0,0 | smd 3.8 x 0.28: PP@1 0,0.275; PP@2 0,-0.275
SOT23-5' = smd 0.55 x 1.2: 1 -0.95,-1.3; 2 0,-1.3; 3 0.95,-1.3; 4 0.95,1.3; 5 -0.95,1.3
JOYSTICK-PSP1000 = smd 1.5 x 4.5: GND -3,7.75; VCC 1,7.75; X 3,7.75; Y -1,7.75 | hole 2: -8.89,8.985; -7.375,-10.06
P1-13 = drill 1.321 pad 2.159 octagon: TP 0,0
FXO-HC735-12.288 = smd 1.8 x 2: 1 -2.54,2.1; 2 2.54,2.1; 3 2.54,-2.1; 4 -2.54,-2.1
51296-5494 = smd 0.3 x 0.9: P$1 0,1.1; P$2 0.5,1.1; P$3 1,1.1; P$4 1.5,1.1; P$5 2,1.1; P$6 2.5,1.1; P$7 3,1.1; P$8 3.5,1.1; P$9 4,1.1; P$10 4.5,1.1; P$11 5,1.1; P$12 5.5,1.1; P$13 6,1.1; P$14 6.5,1.1; P$15 7,1.1; P$16 7.5,1.1; P$17 8,1.1; P$18 8.5,1.1; P$19 9,1.1; P$20 9.5,1.1; P$21 10,1.1; P$22 10.5,1.1; P$23 11,1.1; P$24 11.5,1.1; P$25 12,1.1; P$26 12.5,1.1; P$27 13,1.1; P$28 13.5,1.1; P$29 14,1.1; P$30 14.5,1.1; P$31 15,1.1; P$32 15.5,1.1; P$33 16,1.1; P$34 16.5,1.1; P$35 17,1.1; P$36 17.5,1.1; P$37 18,1.1; P$38 18.5,1.1; P$39 19,1.1; P$40 19.5,1.1; P$41 20,1.1; P$42 20.5,1.1; P$43 21,1.1; P$44 21.5,1.1; P$45 22,1.1; P$46 22.5,1.1; P$47 23,1.1; P$48 23.5,1.1; P$49 24,1.1; P$50 24.5,1.1; P$51 25,1.1; P$52 25.5,1.1; P$53 26,1.1; P$54 26.5,1.1 | smd 1.4 x 1.5: PAD1 -1.55,-2; PAD2 28.05,-2

### Placement (x,y rotation side)
BAT1  68.08,77.47 0 top
BAT2  68.08,102.87 0 top
BBB1  86.36,8.31 0 bottom
BOARD  0,0 0 top
C1  66,53 0 top
C2  79.5,58.5 90 top
C3  82.25,57.5 90 top
C4  22.5,36.5 90 top
C5  15,69.5 90 top
C6  11,69.5 90 top
C7  15,75.5 180 top
C8  11,75.5 180 top
C9  37.5,42.5 90 top
C10  43.5,42.5 90 top
C13  52.5,35 0 top
C14  52.5,33.5 0 top
C15  43.5,29.25 270 top
C16  45,29.25 270 top
C17  52.5,39.5 0 top
C18  52.5,38 0 top
C19  49.5,42.5 90 top
C20  48,42.5 90 top
C21  46.5,42.5 90 top
C22  45,42.5 90 top
C24  22.5,21.25 270 top
C25  22.5,24.75 90 top
C26  17.75,27 0 top
C27  21.25,27 0 top
C28  26.25,30.75 270 bottom
C29  26.75,23.25 90 bottom
C30  7.75,27.25 180 bottom
C31  78.5,13.25 90 bottom
C32  70.75,11.5 270 bottom
C33  81.25,18.5 270 top
C34  7.75,24.75 180 bottom
C35  12.5,27.5 180 top
C36  9.5,21.62 270 top
C37  12.5,19.25 180 top
C38  12.5,17.75 180 top
C39  56.5,39 90 top
C40  62.5,39 90 top
D1  81,52 270 top
FB1  52.5,41.5 180 top
FB2  52.5,43.5 180 top
IC1  76,68 180 top
JP1  78,33.5 270 bottom
JP2  13.5,3 180 bottom
JP3  30.5,40.5 180 bottom
JP4  80.5,8 135 bottom
L1  73.5,60.5 90 top
L3  74,15 0 bottom
LED1  84,50.75 0 top
Q2  76.5,15 180 top
R4  78,53 90 top
R5  77.5,49.5 0 top
R6  84,54 270 top
R7  33,29.5 180 top
R8  36.75,29.5 0 top
R9  32.5,37.5 270 top
R10  81.5,72.5 180 top
R11  76.5,72.5 180 top
R12  79.5,68 90 top
R13  73,68 270 top
R14  15,73.5 0 top
R15  11,73.5 0 top
R16  48.5,28 90 top
R17  47,28 90 top
R18  51.5,28 90 top
R19  50,28 90 top
R20  52.5,32 180 top
R21  40.5,42.5 270 top
R22  42,42.5 270 top
R24  18,32.5 0 top
R25  30.01,25.16 180 top
R64  28.5,39.5 270 bottom
R65  27.5,42 270 bottom
R66  26.5,39.5 270 bottom
R67  74.75,8.25 180 bottom
R68  25.5,42 270 bottom
R69  81.25,15 90 top
R70  79.5,15 90 top
R71  79.5,18.5 90 top
R72  24.5,39.5 270 bottom
R73  23.5,42 270 bottom
R74  22.5,39.5 270 bottom
R75  21.25,39.5 270 bottom
R76  20,39.5 270 bottom
R77  18.75,39.5 270 bottom
R78  17.25,39.5 270 bottom
R79  16,39.5 270 bottom
R80  14.75,39.5 270 bottom
R81  13.5,39.5 270 bottom
R82  12.5,42 270 bottom
R83  11.5,39.5 270 bottom
R84  10.5,42 270 bottom
R85  9.5,39.5 270 bottom
R86  8.5,42 270 bottom
R87  7.5,39.5 270 bottom
R88  29,19 225 bottom
R89  27.75,17.75 225 bottom
R90  26.5,16.5 225 bottom
R91  24.5,17.25 270 bottom
R92  23.5,14.75 270 bottom
R93  22.5,17.25 270 bottom
R94  21.5,14.75 270 bottom
R95  20.5,17.25 270 bottom
R96  19.5,14.75 270 bottom
R97  18.5,17.25 270 bottom
R98  17.5,14.75 270 bottom
R99  16.5,17.25 270 bottom
R100  15.5,14.75 270 bottom
R101  14.5,17.25 270 bottom
R102  13.5,14.75 270 bottom
R103  12.5,17.25 270 bottom
R104  11.5,14.75 270 bottom
R105  10.5,17.25 270 bottom
R106  9.5,14.75 270 bottom
R107  8.5,17.25 270 bottom
SW1  18.03,39.12 90 bottom
SW2  34.75,29.46 0 bottom
SW3  77.47,88.06 0 top
U1  72.5,53 270 top
U2  27.5,36.25 270 top
U3  46.25,36 90 top
U4  3,82.25 0 top
U5  2.95,93.25 0 top
U7  19,23.25 90 top
U8  18.75,26 180 bottom
U9  12.5,23.25 270 top
U10  74,11.25 270 bottom
U11  SN74LVC1G06  [SOT23-5']  76.5,18.5 270 top
U12  TLV70018DDCT  [SOT23-5']  59.5,39 90 top
U$1  66.04,34.29 180 bottom
WP  38.5,37.5 180 bottom
Y1  60,33.5 180 top
ZIF1  39.5,9.5 180 bottom

### Tracks (layer width: path | path; a pad name or v marks a point on that pad's centre or on a via)
ADC_GND  (via drill 0.4, 0.8)
  Top 0.254: JP2.3 18.58,3.08 22,6.5 22,11.25 22.5,11.75 25,11.75 26.04,12.79 BBB1.P9_34 26.04,15.54 26,15.25 26,16.5 29,19.5 29.38,19.5 v30.38,20.5
  Bottom 0.254: v63,28 62.5,28.5 | v63,28 62,29 57.25,29 53,24.75 36.25,24.75 35.5,24 35.5,22.75 34.75,22 32.75,22 31.25,20.5 v30.38,20.5 | v63,28 63,26.58 U$1.GND v63,26.5 v63,25
AGND  (via drill 0.4)
  Top 0.254: U3.26 48.75,38.25 48.5,38 47.5,38 v46.25,36.75 U3.PAD | U3.15 44.5,37.75 v45.5,36.75 | U3.21 47.5,37.25 v47,36.75
  Top 0.406: 5.25,78.3 U4.SLEEVE 5.5,79 | 5.25,90 U5.SLEEVE
  Top 0.61: v36,42.5 25,42.5 18,49.5 8.5,49.5 5.25,52.75 5.25,74.5 | 5.25,74.5 5.25,75.5 | 5.25,75.5 5.25,76.5 | 5.25,76.5 5.25,78.3 | 5.5,79 2.5,82 2.5,88.5 4,90 5.25,90 | 6.25,75.5 8,75.5 | 8,75.5 v9,75.5 | v9,75.5 C8.2 | 5.25,74.5 6.25,75.5 | 6.25,75.5 5.25,76.5 | 5.25,75.5 6.25,75.5 | v13,75.5 C7.2 | 8,75.5 v9,75.5
  Bottom 0.61: v36,42.5 44,42.5 | v9,75.5 v13,75.5
  other vias: 50.5,44.75 54.5,38.75 54.5,40.5 50.25,39.75 47,35.25 45.5,35.25 45.5,36 46.25,35.25 46.25,36 47,36 50.5,45.75 48.75,45.75 47.25,45.75
  pour Bottom: 43.5,33.25 43.5,46.5 52.5,46.5 52.5,42.5 55.5,42.5 55.5,36.5 49,36.5 49,33.25
  pour Top: 43.5,33.25 43.5,46.5 52.5,46.5 52.5,42.5 55.5,42.5 55.5,36.5 49,36.5 49,33.25
AUD_BCLK  (via drill 0.4)
  Top 0.254: BBB1.P9_31 28.57,10.07 30,11.5 30,16.5 32,18.5 32,20 29.75,22.25 v29.75,23.75 | U3.38 48.5,31.75 v49,31.25
  Bottom 0.254: v29.75,23.75 29.75,25 28.75,26 28.75,27.75 29.75,28.75 34,28.75 35.25,30 40.75,30 47.75,30 v49,31.25
AUD_DIN  (via drill 0.4)
  Top 0.254: BBB1.P9_25 36.2,10.3 35,11.5 35,19.25 33.62,20.62 33.25,21 32.75,21.5 v32.75,23.75 | v41.5,26.5 42,26 42.5,25.5 47.5,25.5 48.5,26.5 R16.1 R19.1
  Bottom 0.254: v32.75,23.75 32.75,24.75 33,25 36.5,28.5 37.5,28.5 39.5,28.5 v41.5,26.5
AUD_DOUT  (via drill 0.4)
  Top 0.254: BBB1.P9_28 33.66,19.84 31.75,21.75 v31.75,23.75 | v42.75,26.5 43.25,26 46.5,26 47,26.5 R17.1 | 51.5,27.5 R18.1 51.6,27.25 v52.75,27.25
  Bottom 0.254: v31.75,23.75 31.75,24 31.75,24.5 36.25,29 37.75,29 40.25,29 v42.75,26.5 52,26.5 v52.75,27.25
AUD_FSX  (via drill 0.4)
  Top 0.254: BBB1.P9_29 31.11,10.12 32.5,11.5 32.5,20.25 30.75,22 v30.75,23.75 | U3.39 48,31 48.5,30.5 v50.25,30.5
  Bottom 0.254: v30.75,23.75 30.75,24 30.75,24.25 31.5,25 36,29.5 37.5,29.5 40.5,29.5 41.5,29.5 48.5,29.5 49.5,30.5 v50.25,30.5
AUD_MCLK  (via drill 0.4)
  Top 0.254: 51.5,31.85 R20.2 v50,32 49.5,32.5 U3.37 | v28.75,23.75 28.75,22.25 24.5,18 16.5,18 14.75,16.25 14.75,11.25 15.25,10.75 15.88,10.12 BBB1.P9_41
  Bottom 0.254: v28.75,23.75 28.75,25 28,25.75 28,28 29.5,29.5 33.5,29.5 34.5,30.5 37,30.5 47,30.5 48.5,32 v50,32
B_LCD_DCLK
  Bottom 0.254: 58,8.75 ZIF1.P$38 58,11 48.75,20.25 33.25,20.25 30.5,17.5 30.29,17.29 R89.2
B_LCD_EN
  Bottom 0.254: ZIF1.P$52 65,9.5 64.5,10 59.75,10 49,20.75 33,20.75 30.75,18.5 30.71,18.54 R88.2
B_LCD_HSYNC
  Bottom 0.254: 57,8.25 ZIF1.P$36 57,10.5 48.25,19.25 33.75,19.25 28.5,14 26,14 24.5,15.5 R91.2
B_LCD_VSYNC
  Bottom 0.254: 57.5,8.5 ZIF1.P$37 57.5,10.75 48.5,19.75 33.5,19.75 30.25,16.5 29.79,16.04 R90.2
BAT_I_MON
  Top 0.406: BBB1.P9_33 26.04,7.46 27.5,6 34.5,6 81,6 86.5,11.5 86.5,58.25 82,62.75 82,66 82,67.5 80.65,68.85 R12.2 77.41,68.85 IC1.1
BAT_V_MON
  Top 0.406: R10.2 R11.1 | R10.2 | 81.12,70.62 83,68.75 83,66 83,63 87.5,58.5 87.5,11 82.5,6 82,5.5 | 81.12,70.62 80.75,71 | R10.2 80.65,71.1 81.12,70.62 | BBB1.P9_35 23.5,7.5 24.5,6.5 25.5,6.5 26.75,5.25 27.5,4.5 61.25,4.5 62,5.25 65,5.25 65.75,4.5 81,4.5 82,5.5 | 82,5.5 81.75,5.25
DGND  (via drill 0.4, 0.6)
  Top 0.254: 46.5,31.5 v46.25,31.25 | U3.42 46.5,31.5 | 46.5,31.5 v46.25,31.25 | v46.25,31.25 46,31.5 U3.43 | U7.5 U8.39 | U7.4 19.25,21.85 | U7.3 18.75,21.85 | U7.2 18.25,21.85 18.1,22 U7.27 | C39.2 56.5,40 57.25,40.75 59,40.75 59.5,40.25 v59.5,39
  Top 0.406: C39.2 56.5,40 | U2.1 23.3,38.16 C4.2
  Bottom 0.254: U10.PP U10.8 71.35,11.25 C32.2 | U10.4 74.78,10.75 U10.PP@2
  other vias: 84,56 79.75,62.75 77,51 71.75,53.5 73.25,53.5 71.75,52.25 73.25,52.25 54.75,34.25 55.75,34.25 40,11.5 64.75,38.75 64.75,37.25 60,33.5 60,31.5 24.5,26 24.5,25 26.5,21.25 19.75,23.75 9.75,25 9.75,27 70.5,9.25 70.5,8.25 84.75,20 84.75,18 84.75,16 84.75,14 33.5,2.75 36.5,2.75 39.5,2.75 42.5,2.75 3.75,33 3.75,36 3.75,30 3.75,27 47,53 44,53 50,53 53,53 83.75,33 83.75,36 83.75,30 83.75,27 83.75,48 83.75,45 83.75,42 83.75,39 3.75,48 3.75,45 3.75,42 3.75,39 48.5,2.75 45.5,2.75 51.5,2.75 54.5,2.75 12,6.25 10.5,6.25 9,6.25 9,7.75 9,9.25 12,5.25 10.5,5.25 9,5.25 8,6.25 8,7.75 8,9.25 8,5.25 41,37 41.5,35.5 74,11.75 74,10.75 78.5,63.75 78.5,62.75 79.75,63.75 81.25,60.75 82.25,59.75 52.75,20.5 54.75,20.5 56.75,20.5 58.75,20.5 60.75,20.5 56.75,18.5 58.75,18.5 70.75,15 70.75,14 68.25,8.5 68.25,7.5 67.25,17 68.25,17 69.25,17 68.25,16 75.25,25.5 75.25,24 76.75,24 76.75,25.5 78.25,25.5 78.25,24 73.75,20.5 74.75,20.5 83.25,20 83.25,18
  pour Top (rank 6): 91,122.48 91,-1.93 -1.89,-1.93 -1.89,122.48
  pour Bottom (rank 6): -1,121.5 90,121.5 90,-1 -1,-1
  pour Bottom (no thermals): 71.25,11.12 71.25,9 70.25,9 70.25,11.12
DGND3  (via drill 0.4)
  other vias: 41,53
EHRPWM1A  (via drill 0.4)
  Top 0.254: BBB1.P9_14 51.44,15.19 v53.75,17.5
  Top 0.406: U11.2 72.5,18.5 v68.5,14.5
  Bottom 0.406: v53.75,17.5 56.75,14.5 v68.5,14.5
I2C2_SCL  (via drill 0.4)
  Top 0.254: BBB1.P9_19 43.81,10.31 45,11.5 45,16.5 41,20.5 36.5,20.5 35.25,21.75 35.25,27 35.25,27.5 35.25,28 35.9,28.65 R8.1 | 35.25,33.5 35.25,33.25 | U9.2 14.8,22.05 15.5,22.75 v15.5,24 | U7.24 17.75,23.5 v18.25,23.88 | v15,26 15,29.25 16,30.25 21.25,30.25 23,30.25 25.75,33 26.5,33.75 28.25,35.5 29.46,35.5 | U3.1 35.5,33.25 35.25,33.5 | 29.46,35.5 29.48,35.5 U2.6 29.46,35.5 | 34.88,33.88 33.25,35.5 29.46,35.5 | 34.88,33.88 35.12,33.62 | 35.12,33.62 35.25,33.5 | 35.25,33.5 35.25,33.25 | R8.1 36.25,29.35 | 35.25,33.25 35.25,31.5 35.25,31 35.75,30.5 35.75,29.65 R8.1 | 35.12,33.62 35,33.75 | v34.75,36.75 34.75,34 34.88,33.88
  Bottom 0.254: v15,26 15,24.5 v15.5,24 18,24 v18.25,23.88 | JP3.2 33.04,40.46 34.75,38.75 v34.75,36.75
I2C2_SDA  (via drill 0.4)
  Top 0.254: BBB1.P9_20 43.81,16.18 40.25,19.75 36.25,19.75 34.5,21.5 34.5,27 34.5,27.5 34.5,28 33.85,28.65 R7.1 | U3.2 41.75,33.75 36.5,33.75 v36,34.25 v36,36.75 | U9.3 14.35,22.85 14.75,23.25 14.75,24 14.75,24.5 15.75,25.5 | 15.75,25.5 15.75,28.75 16,29 16.5,29.5 21.5,29.5 23.5,29.5 26.75,32.75 27.5,33.5 28.25,34.25 29.45,34.25 | U7.28 16.5,21.5 16.25,21.75 16.25,25 15.75,25.5 | 29.45,34.25 29.75,34.25 U2.5 29.45,34.25 | 29.45,34.25 v33.25,34.25 34.5,33 34.5,31.5 34.5,31 33.85,30.35 R7.1 | R7.1 33.5,29.35
  Bottom 0.254: v33.25,34.25 35.5,34.25 v36,34.25 | JP3.3 35.58,37.17 v36,36.75
JOY_X  (via drill 0.4, 0.8)
  Top 0.254: JP2.1 18.41,7.92 BBB1.P9_39 18.41,10.34 17.25,11.5 17.25,16.25 18.5,17.5 25,17.5 26.5,19 29,21.5 v29.12,21.5
  Bottom 0.254: v69,25 v69,26.5 U$1.X 69,26.58 v69,28 69,29 68,30 56.75,30 52.5,25.75 35.75,25.75 34.5,24.5 34.5,23.25 34.25,23 32.25,23 31.25,22 29.62,22 v29.12,21.5
JOY_Y  (via drill 0.4, 0.8)
  Top 0.254: JP2.2 16.04,3.04 21,8 21,8.96 BBB1.P9_37 20.95,10.29 19.75,11.5 19.75,16.25 20.5,17 25.5,17 29,20.5 v29.25,20.5
  Bottom 0.254: v65,25 v65,26.5 U$1.Y 65,26.58 v65,28 65,29 64.5,29.5 57,29.5 52.75,25.25 36,25.25 35,24.25 35,23 34.5,22.5 32.5,22.5 31.5,21.5 30.62,21.5 30.25,21.5 30,21.25 v29.25,20.5
LCD_B0
  Bottom 0.254: R107.2 8.5,13.5 16,6 33.75,6 34.25,6 35,6 38.25,9.25 46.25,9.25 46.5,9 ZIF1.P$15
LCD_B1
  Bottom 0.254: R106.2 9.5,13.5 16.5,6.5 34.75,6.5 38,9.75 40.25,9.75 46.5,9.75 47,9.25 ZIF1.P$16
LCD_B2
  Bottom 0.254: R105.2 10.5,13.5 17,7 34.5,7 37.75,10.25 40,10.25 46.75,10.25 47.5,9.5 ZIF1.P$17
LCD_B3
  Bottom 0.254: R104.2 11.5,13.5 17.5,7.5 31.75,7.5 34.5,10.25 37,12.75 45,12.75 48,9.75 ZIF1.P$18
LCD_B4
  Bottom 0.254: ZIF1.P$12 ZIF1.P$13 ZIF1.P$14 46,7.5 46.5,7 48,7 48.5,7.5 ZIF1.P$19 | ZIF1.P$19 48.5,7.75 | R103.2 12.5,13.5 18,8 31.5,8 36.75,13.25 45.25,13.25 48.5,10 ZIF1.P$19
LCD_DATA0  (via drill 0.4)
  Top 0.254: BBB1.P8_45 10.79,54.95 v11,54.75
  Bottom 0.254: R87.1 7.5,43.25 11,46.75 v11,54.75
LCD_DATA1  (via drill 0.4)
  Top 0.254: BBB1.P8_46 10.79,60.95 v12,59.75
  Bottom 0.254: R86.1 8.5,43.5 12,47 v12,59.75
LCD_DATA2  (via drill 0.4)
  Top 0.254: BBB1.P8_43 13.34,55.09 v13,54.75
  Bottom 0.254: v13,54.75 13,47.25 9.5,43.75 R85.1
LCD_DATA3  (via drill 0.4)
  Top 0.254: BBB1.P8_44 13.34,60.91 v14.5,59.75
  Bottom 0.254: R84.1 10.5,44 14.25,47.75 14.25,52.25 14.25,59.5 v14.5,59.75
LCD_DATA4  (via drill 0.4)
  Top 0.254: BBB1.P8_41 15.88,55.12 v15.5,54.75
  Bottom 0.254: v15.5,54.75 15.5,52.75 14.75,52 14.75,47.5 11.5,44.25 R83.1
LCD_DATA5  (via drill 0.4)
  Top 0.254: BBB1.P8_42 15.88,60.88 v17,59.75
  Bottom 0.254: R82.1 12.5,44.5 15.25,47.25 15.25,51.75 17,53.5 v17,59.75
LCD_DATA6  (via drill 0.4)
  Top 0.254: BBB1.P8_39 18.41,55.16 v18,54.75
  Bottom 0.254: v18,54.75 18,53.75 15.75,51.5 15.75,47 13.5,44.75 R81.1
LCD_DATA7  (via drill 0.4)
  Top 0.254: BBB1.P8_40 18.41,60.84 v19.5,59.75
  Bottom 0.254: R80.1 14.75,40.75 14,41.5 14,42.5 14,44.25 14,44.5 16.25,46.75 16.25,51.25 19,54 19,59.25 v19.5,59.75
LCD_DATA8  (via drill 0.4)
  Top 0.254: BBB1.P8_37 20.95,55.2 v20.5,54.75
  Bottom 0.254: R79.1 16,40.75 17.25,42 17.25,50.75 20.5,54 v20.5,54.75
LCD_DATA9  (via drill 0.4)
  Top 0.254: BBB1.P8_38 20.95,61.05 v22,59.75
  Bottom 0.254: R78.1 17.25,41.25 17.75,41.75 17.75,50.5 22,54.75 v22,59.75
LCD_DATA10  (via drill 0.4)
  Top 0.254: BBB1.P8_36 23.5,61.01 v24.5,59.75
  Bottom 0.254: R77.1 18.75,41.25 18.25,41.75 18.25,44.25 18.25,44.5 18.25,50.25 24.5,56.5 24.5,58.25 v24.5,59.75
LCD_DATA11  (via drill 0.4)
  Top 0.254: BBB1.P8_34 26.04,60.97 v27,59.75
  Bottom 0.254: R76.1 20,40.75 18.75,42 18.75,44.5 18.75,50 27,58.25 v27,59.75
LCD_DATA12  (via drill 0.4)
  Top 0.254: v24.75,54.75 23.5,56 BBB1.P8_35
  Bottom 0.254: R75.1 21.25,40.75 22,41.5 22,50.75 24.75,53.5 v24.75,54.75
LCD_DATA13  (via drill 0.4)
  Top 0.254: BBB1.P8_33 26.04,54.78 v26,54.75
  Bottom 0.254: v26,54.75 26,54 22.5,50.5 R74.1
LCD_DATA14  (via drill 0.4)
  Top 0.254: BBB1.P8_31 28.57,55.08 v28.25,54.75
  Bottom 0.254: R73.1 23.5,43.5 23,44 23,50.25 26.5,53.75 27.25,53.75 v28.25,54.75
LCD_DATA15  (via drill 0.4)
  Top 0.254: BBB1.P8_32 28.57,60.92 v29.5,59.75
  Bottom 0.254: R72.1 24.5,43.5 23.5,44.5 23.5,50 26.75,53.25 28.25,53.25 29.5,54.5 v29.5,59.75
LCD_EN  (via drill 0.4)
  Top 0.254: BBB1.P8_30 31.11,60.88 v32,59.75
  Bottom 0.254: R64.1 28.5,43.5 25.5,46.5 25.5,49 27.75,51.25 32.25,51.25 35.5,54.5 35.5,60 34.75,60.75 33,60.75 v32,59.75
LCD_G0
  Bottom 0.254: R102.2 13.5,13.5 18.5,8.5 31.25,8.5 36.5,13.75 45.5,13.75 50,9.25 ZIF1.P$22
LCD_G1
  Bottom 0.254: R101.2 14.5,13.5 19,9 31,9 36.25,14.25 45.75,14.25 50.5,9.5 ZIF1.P$23
LCD_G2
  Bottom 0.254: R100.2 15.5,13.5 19.5,9.5 30.75,9.5 36,14.75 46,14.75 51,9.75 ZIF1.P$24
LCD_G3
  Bottom 0.254: R99.2 16.5,13.5 20,10 30.5,10 35.75,15.25 46.25,15.25 51.5,10 ZIF1.P$25
LCD_G4
  Bottom 0.254: R98.2 17.5,13.5 20.5,10.5 30.25,10.5 35.5,15.75 46.5,15.75 52,10.25 ZIF1.P$26
LCD_G5
  Bottom 0.254: ZIF1.P$20 ZIF1.P$21 49.5,7.5 50,7 52,7 52.5,7.5 ZIF1.P$27 | ZIF1.P$27 52.5,8.25 | R97.2 18.5,13.5 21,11 30,11 35.25,16.25 46.75,16.25 52.5,10.5 ZIF1.P$27
LCD_HSYNC  (via drill 0.4)
  Top 0.254: v30.75,54.75 31,55 31,57.15 BBB1.P8_29
  Bottom 0.254: R68.1 25.5,43.5 24,45 24,49.75 27,52.75 28.75,52.75 v30.75,54.75
LCD_PCLK  (via drill 0.4)
  Top 0.254: BBB1.P8_28 33.66,60.84 v34.5,59.75
  Bottom 0.254: R65.1 27.5,43.5 25,46 25,49.25 27.5,51.75 31.5,51.75 34.5,54.75 v34.5,59.75
LCD_R0
  Bottom 0.254: R96.2 19.5,13.5 21.5,11.5 29.75,11.5 35,16.75 47,16.75 54.5,9.25 ZIF1.P$31
LCD_R1
  Bottom 0.254: R95.2 20.5,13.5 22,12 29.5,12 34.75,17.25 47.25,17.25 55,9.5 ZIF1.P$32
LCD_R2
  Bottom 0.254: R94.2 21.5,13.5 22.5,12.5 29.25,12.5 34.5,17.75 47.5,17.75 55.5,9.75 ZIF1.P$33
LCD_R3
  Bottom 0.254: R93.2 22.5,13.5 23,13 29,13 34.25,18.25 47.75,18.25 56,10 ZIF1.P$34
LCD_R4
  Bottom 0.254: ZIF1.P$35 56.5,7.5 56,7 54.5,7 54,7.5 ZIF1.P$30 ZIF1.P$29 ZIF1.P$28 | ZIF1.P$35 56.5,8 | 23.5,14 R92.2 23.6,14 23.75,14 24.25,13.5 28.75,13.5 34,18.75 48,18.75 56.5,10.25 ZIF1.P$35
LCD_VSYNC  (via drill 0.4)
  Top 0.254: v33.25,54.75 33.5,55 33.5,57.11 BBB1.P8_27
  Bottom 0.254: R66.1 26.5,43.5 24.5,45.5 24.5,49.5 27.25,52.25 30.75,52.25 v33.25,54.75
LED+  (via drill 0.4)
  Top 0.406: v69.5,7 76.5,7 79.5,7 JP4.1
  Bottom 0.254: ZIF1.P$3 40.5,7.5 40.75,7.25 41,7.5 ZIF1.P$4 | U10.9 71.35,11.75 C32.1
  Bottom 0.406: 40.75,7.25 40.75,7 41.5,6.25 41.75,6 68,6 68.5,6 v69.5,7 69.5,9.25
  pour Bottom (no thermals): 71.5,11.75 69.75,11.75 69.75,9 69.12,9 69.12,13 71.5,13
LED-
  Bottom 0.254: 75.47,8.38 U10.5 | ZIF1.P$1 39.5,7.5 39.75,7.25 40,7.5 ZIF1.P$2
  Bottom 0.406: 75.5,8.15 R67.2 | R67.2 75.47,8.38 | 39.75,7.25 39.75,6.75 41.25,5.25 44.25,5.25 68,5.25 71.5,5.25 72.5,5.25 73.75,5.25 75.5,7 75.5,8.15 | 75.5,8.15 R67.2 | R67.2 77.75,8.25 79.5,10 82.09,10 JP4.2
N$1
  pour Top (no thermals): 75,62 75,60 73.5,58.5 71,58.5 68.5,56 68.5,54.5 71,54.5 71,55.5 71.5,56 74.5,56 77.5,59 77.5,62
N$2
  Top 0.254: WP.TP 35.25,37.5 34.25,37.5 33.62,36.88 | 33.62,36.88 33.5,36.75 | R9.2 33.4,36.65 33.62,36.88
  Top 0.406: U2.7 32.27,36.88 R9.2
N$4
  Bottom 0.254: R64.2 28.5,36 24.25,31.75 U8.27
N$5
  Top 0.254: U1.12 76.83,52.67 77.25,52.25 77.9,52.25 R4.1
  Top 0.406: R5.2 78.35,50.65 78,51 R4.1 | R4.1
N$6
  pour Top (no thermals): 76,54.75 74.25,54.75 74.25,53.25 79.5,53.25 80,52.75 82.25,52.75 83.25,53.75 83.25,57.25 81.25,57.25 80.5,58 78.5,58 78.5,56.25 77,54.75
N$7
  Top 0.254: R6.2 LED1.C
N$8  (via drill 0.4)
  Top 0.254: v46,40.5 U3.18
  Top 0.406: v42.5,46.5 28,46.5 27,46.5 20,53.5 10.5,53.5 9.25,54.75 9.25,64.5 10.25,65.5 13.5,65.5 15,67 C5.1
  Bottom 0.406: v46,40.5 46,43 v42.5,46.5
N$9  (via drill 0.4)
  Top 0.254: v48.5,40.5 U3.23
  Top 0.406: v46,45.5 26.5,45.5 19.5,52.5 10,52.5 8.25,54.25 8.25,65.25 9.75,66.75 | 9.75,66.75 10,67 | C6.1 11,68 9.75,66.75
  Bottom 0.406: v48.5,40.5 48.5,43 v46,45.5
N$10
  Top 0.61: R14.1 14.15,71.75 C5.2
N$11
  Top 0.61: R15.1 10.15,71.75 C6.2
N$12
  Top 0.406: U4.TIP 14.7,78.7 14,78
  Top 0.61: R14.2 C7.1 15.85,77.65 U4.TIP
N$13
  Top 0.61: R15.2 C8.1 11.85,81.15 U4.RING
N$14
  Top 0.254: U7.15 20.25,26.85 C27.1
N$15
  Top 0.406: U9.12 10.7,22.05 10.5,22.25 10.28,22.48 C36.1
N$16
  Top 0.406: U9.13 10.75,21.25 10.5,21 10.28,20.77 C36.2
N$17
  Bottom 0.254: R65.2 27.5,35.75 23.75,32 U8.26
N$18  (via drill 0.4)
  Top 0.406: C10.2 R22.1 42,44 41.5,44.5 28.5,44.5 28,44.5 26,44.5 19,51.5 9.5,51.5 7.25,53.75 7.25,66.25 v8,67 | v9.5,94.5 9.45,94.5 U5.RING
  Bottom 0.406: v8,67 8,76.5 9.5,78 v9.5,94.5
N$19
  Top 0.254: U3.41 R17.2 R16.2
N$20
  Top 0.254: U3.40 47.5,30.75 48.25,30 49.5,30 50,29.5 R19.2 R18.2
N$21
  Bottom 0.254: R66.2 26.5,35.5 22.75,31.75 U8.24
N$22
  Top 0.406: U9.6 13.6,27 C35.1
N$23
  Top 0.254: U3.11 40.25,38.25 37.5,41 C9.1
N$24
  Top 0.254: U3.14 44,40.5 43.5,41 C10.1
N$25
  Top 0.406: R20.1 54.86,32 55,32 57.5,34.5 57.5,35.56 Y1.3
N$26
  Top 1.27: 68,96.44 BAT2.+ 68.1,96.5 | BAT1.+ 67.88,71.12
  Top 1.676: 67.88,71.12 63.5,75.5 63.5,91.94 BAT2.+ | SW3.2 80.56,88.06 83,90.5 83,94 80.5,96.5 68.1,96.5
N$27
  Top 0.254: U3.13 43.5,40 43,40.5 42.5,40.5 42,41 R22.2
  Top 0.406: R21.2 R22.2
N$28  (via drill 0.4)
  Top 0.254: U3.12 41.5,38.75 41.25,38.75 39,41 39,43
  Top 0.406: R21.1 40.35,43.5 39.5,43.5 | 38.5,43.5 39,43 39.5,43.5 | 38.5,43.5 39.5,43.5 | 38.5,43.5 37.65,43.5 C9.2 37.35,43.5 36,43.5 28,43.5 25.5,43.5 18.5,50.5 9,50.5 6.25,53.25 6.25,67 v6.5,67.5 | v8.5,88.5 9.75,89.75 14.6,89.75 U5.TIP
  Bottom 0.406: v6.5,67.5 7,68 7,77 8.5,78.5 v8.5,88.5
N$29
  Bottom 0.254: R68.2 25.5,35.25 22.25,32 U8.23
N$30
  Bottom 0.254: R72.2 24.5,35 21.25,31.75 U8.21
N$31
  Bottom 0.254: R73.2 23.5,34.75 20.75,32 U8.20
N$32
  Bottom 0.254: R74.2 22.5,34.5 20.25,32.25 U8.19
N$33
  Bottom 0.254: R75.2 21.25,38.75 19.25,36.75 U8.17
N$34
  Bottom 0.254: R76.2 20,38.25 19.62,37.88 19.5,37.75 18.75,37 U8.16
N$35
  Bottom 0.254: R77.2 18.75,38.25 18.25,37.75 U8.15
N$36
  Bottom 0.254: U8.55 11.75,20.5 11,20 10,20 8.5,18.5 R107.1
N$37
  Bottom 0.254: U8.54 12.25,20.25 11.25,19.5 10.5,19.5 9.5,18.5 R106.1
N$38
  Bottom 0.254: U8.52 13.25,20.5 11.5,19 11,19 10.5,18.5 R105.1
N$39
  Bottom 0.254: U8.51 13.75,20.25 11.5,18.25 R104.1
N$40
  Bottom 0.254: U8.49 14.75,20.5 12.5,18.25 R103.1
N$41
  Bottom 0.254: U8.48 15.25,20.25 13.5,18.5 R102.1
N$42
  Bottom 0.254: U8.38 20.25,20 21.5,18.75 R94.1
N$43
  Bottom 0.254: U8.45 16.75,19.75 15.5,18.5 R100.1
N$44
  Bottom 0.254: U8.44 17.25,19.25 16.5,18.5 R99.1
N$45
  Bottom 0.254: U8.43 17.75,18.75 17.5,18.5 R98.1
N$46
  Bottom 0.254: U8.47 15.75,20 14.5,18.75 R101.1
N$103
  Bottom 0.254: R86.2 8.5,35.75 12.25,32 U8.3
N$104
  Bottom 0.254: R85.2 9.5,35.5 13.25,31.75 U8.5
N$105
  Bottom 0.254: R84.2 10.5,35.25 13.75,32 U8.6
N$107
  pour Bottom (no thermals): 75,12.12 75,13 74.5,13.5 74.5,16.38 75.88,16.38 75.88,12.12
N$108
  pour Bottom (no thermals): 73,12.12 72.12,12.12 72.12,16.38 73.5,16.38 73.5,13.5 73,13
N$109  (via drill 0.4)
  Top 0.406: R70.2 R69.2 82.15,15.85 82.5,15.5 82.5,12.5 v81.25,11.25
  Bottom 0.254: U10.3 77.6,11.25 77.75,11.25 v81.25,11.25
N$110
  Top 0.254: Q2.3 76.75,14.15
  Top 0.406: 76.75,14.15 R70.1
N$111
  Top 0.254: 79.4,17.55 R71.1
  Top 0.406: 79.4,17.55 U11.4 77.45,17.2 Q2.1
N$117
  Bottom 0.254: R78.2 17.25,38.25 17.75,37.75 U8.14
N$118
  Bottom 0.254: R79.2 16,38.25 17.25,37 U8.13
N$119
  Bottom 0.254: R80.2 14.75,38.75 16.75,36.75 U8.12
N$120
  Bottom 0.254: R81.2 13.5,34.5 15.75,32.25 U8.10
N$121
  Bottom 0.254: R82.2 12.5,34.75 15.25,32 U8.9
N$122
  Bottom 0.254: R83.2 11.5,35 14.75,31.75 U8.8
N$126
  Bottom 0.254: R87.2 7.5,36 11.75,31.75 U8.2
N$149
  Bottom 0.254: U8.33 22.75,20.5 24.5,18.75 25.25,18.75 25.75,18.25 25.75,17.25 R90.1
N$151
  Bottom 0.254: U8.36 21.25,20.5 23.5,18.25 R92.1
N$157
  Bottom 0.254: U8.42 18.25,18.75 18.5,18.5 R97.1
N$158
  Bottom 0.254: U8.41 18.75,19.25 19.5,18.5 R96.1
N$159
  Bottom 0.254: U8.40 19.25,19.75 20.5,18.5 R95.1
N$161
  Bottom 0.254: U8.37 20.75,20.25 22.5,18.5 R93.1
N$163
  Bottom 0.254: U8.34 22.25,20.25 24.5,18 R91.1
N$165
  Bottom 0.254: U8.31 23.75,20.25 24.75,19.25 25.25,19.25 25.75,19.25 26,19.25 R89.1
N$166
  Bottom 0.254: U8.30 24.25,20.5 25,19.75 26.25,19.75 28.25,19.75 R88.1
SW1  (via drill 0.4)
  Top 0.254: v37.5,59.75 36.25,61 36.25,62.16 BBB1.P8_26
  Top 0.406: SW1.1B 15.49,39.5 SW1.1A 15.49,33.01 16,32.5 R24.1
  Bottom 0.254: SW1.1B 15.49,45.24 16.75,46.5 16.75,50 16.75,51 19.5,53.75 19.5,55 20.75,56.25 20.75,60.25 22,61.5 31,61.5 35.75,61.5 v37.5,59.75
SW2  (via drill 0.4)
  Top 0.254: BBB1.P9_23 38.73,10.27 37.5,11.5 37.5,17.5 36,19 35.75,19.25 33.75,21.25 v33.75,23.75
  Top 0.406: v33.75,23.75 33.75,24.75 33.34,25.16 R25.1 30.86,26.85 SW2.1B
  Bottom 0.254: SW2.1A 35.92,26.92 33.75,24.75 v33.75,23.75
SYS_5V
  Top 0.813: BBB1.P9_7 BBB1.P9_8
VADC  (via drill 0.4, 0.8)
  Top 0.254: v67,28 67,29 66.5,29.5 59,29.5 v57.5,28 | JP2.4 21.12,4.62 21.5,5 22.5,6 22.5,9.5 22.5,11 22.75,11.25 23.75,11.25 25,11.25 27,11.25 28.57,12.82 BBB1.P9_32 28.57,17.57 v30.5,19.5
  Bottom 0.254: v67,25 v67,26.5 U$1.VCC 67,26.58 v67,28 | v30.5,19.5 31,19.5 31.25,19.75 33,21.5 35,21.5 36,22.5 36,23.75 36.5,24.25 53.25,24.25 56.5,27.5 57,28 v57.5,28
VBAT  (via drill 0.4, 0.8, 1)
  Top 0.254: U1.9 72.72,50.73 v72.5,50.5 | U1.6 68.53,52.02 v68,51.5 65.5,51.5 65,52 C1.1
  Top 0.406: IC1.4 73.12,66.69 R13.2
  Top 1.27: v62.5,53 C1.1 | v62.5,53 | R13.2 | v70.5,63
  Top 1.676: R13.2 73,65.5 v70.5,63 L1.P$1
  Bottom 0.254: v72.5,50.5 69,50.5 v68,51.5
  Bottom 1.27: v62.5,53 62.5,54.5 v70.5,63
VBAT_RAW
  Top 0.406: 73,72.5 R11.2 | 73,72.5 | IC1.3 73.12,69.31 R13.1
  Top 1.676: R13.1 73,72.5 73,78.84 SW3.1
VDD_1V8
  Top 0.254: U3.36 51.4,33.25 C14.1
  Top 0.406: C14.1 C13.1 51.65,35.65 52.5,36.5 54,36.5 54.85,36.5 C39.1 56.6,38.05 58.1,38.05 U12.5
VDD_3V3  (via drill 0.4)
  Top 0.254: U7.16 19.75,25 20.25,24.5 U7.13 | 64,7.5 64,8.87 BBB1.P9_3 | U3.46 44.5,32 45,31.5 | U3.44 45.5,32 45,31.5 | 45,31.5 U3.45 | U7.25 17.75,23 18.5,23 19,23.5 19,24.5 18.75,24.75 18,24.75 17.75,24.5 U7.22 U7.21 17.14,25.11 16.75,25.5 16.75,26.85 C26.1 | U12.3 60.8,41.3 61,41.5 | R8.2 39,29.5 v40.75,31.25 | C26.1 17.15,26.65 | v16.75,28 16.75,27.15 C26.1
  Top 0.305: U7.14 U7.13 U7.12 U7.11 U7.10 | U7.10 U7.9 U7.8 U7.7 | C24.1 22.5,22.5 22.5,23 | U7.10 22,23 22.5,23 | U7.22 U7.23 | 22.5,23 C25.1
  Top 0.406: U9.14 12.6,21.25 U9.1 13.6,19.75 C37.1 C38.1 14.5,17.75 16,19.25 23.75,19.25 25.5,21 25.5,22.5 | v63,7 63.5,7 64,7.5 | 76.95,66.55 IC1.5 76.95,66.05 77,66 77.5,65.5 80,65.5 81,64.5 81,62.5 85.5,58 85.5,44 85.5,40.5 85.5,24 83.5,22 80,22 | 45,31.5 v45,31.25 C16.1 C15.1 | v33.75,38.25 32.6,38.25 R9.1 32.3,38.16 U2.8 28.16,38.16 27.5,37.5 27.5,36.5 26.61,35.62 U2.3 23.29,35.62 22.54,35.62 C4.1 22.5,34 21,32.5 R24.2 | v28,29.5 R7.2 | 25.5,23.5 25.5,24.75 | 25.5,24.75 25.5,25.5 | 25.5,25.5 v25.5,27 | 25.5,23.5 25,23 | 25,23 22.5,23 | 25.5,22.5 25.5,23.5 | 25.5,22.5 25,23 | 25.84,25.16 R25.2 | 25.5,25.5 25.84,25.16 | 25.84,25.16 25.84,25.09 25.5,24.75 | 69,19 69.25,18.75 | U11.5 79.4,19.45 R71.2 C33.1 81.25,20.75 80,22 | 73,22 80,22 | JP1.3 73.08,28.42 73,28.5
  Top 0.61: FB1.1 61,41.5 64,41.5 66,39.5 v66,35.5 | 62.4,38.05 U12.1 | 62.4,38.05 C40.1 | 62.4,38.05 62.4,35.74 Y1.4
  Top 1.27: BBB1.P9_3 BBB1.P9_4 64.14,16.64 66.5,19 69,19 70,19 73,22 73,28.5 v66,35.5 62.64,35.5 Y1.4
  Bottom 0.254: 14.25,28.5 U8.7 | 14.25,23.5 U8.50 | 21.75,23.5 U8.35 | 21.75,28.5 U8.22 | 59.5,7.25 ZIF1.P$41 | 60,7.25 ZIF1.P$42 | v45,31.25 v40.75,31.25
  Bottom 0.406: v63,7 59.75,7 | 59.75,7 59.5,7.25 | 59.75,7 60,7.25 | 14.25,23.5 13.75,24 9,24 8.75,24.25 8.75,24.6 C34.2 8.75,24.9 8.75,25.5 | 21.75,23.5 22.35,24.1 C29.2 26.75,25.75 v25.5,27 17.25,27 | 14.25,28.5 13.75,28 9,28 8.75,27.75 8.75,27.4 C30.2 8.75,27.1 8.75,26.5 | 21.75,28.5 22.35,27.9 23.9,27.9 24.9,27.9 26.25,29.25 C28.2 27.9,29.9 28,30 | v33.75,38.25 33.75,35.75 34,35.5 | 16.25,27 14.5,27 13.5,26 9.6,26 | 17.25,27 16.25,27 | 9.6,26 9.25,26 | 9.25,26 8.75,26.5 | 9.6,26 9.25,26 | 9.25,26 8.75,25.5 | 16.75,27.5 v16.75,28 16.75,27.5 | 17.25,27 16.75,27.5 | 16.25,27 16.75,27.5 | 8.75,26.5 8.75,25.5
  Bottom 0.813: v66,35.5 53,35.5 50.5,33 45,33 | 45,33 43,33 42,33 39.5,35.5 34,35.5 30.5,35.5 28,33 28,30 v28,29.5 v25.5,27 | 45,33 v45,31.25
VDD_5V  (via drill 0.4, 1)
  Top 0.254: D1.C LED1.A
  Top 0.406: v72.5,9 76.75,9 v80,12.25
  Top 0.813: BBB1.P9_5 BBB1.P9_6
  Top 1.27: BBB1.P9_5 v61.59,17.09 | v81,48 D1.C
  Bottom 0.254: U10.7 U10.6 72.53,9.53 v72.5,9 | v80,12.25 78.65,12.25 C31.1
  Bottom 0.406: JP1.2 80.96,30.96 81,31
  Bottom 0.813: 76.88,19 76.88,16.25
  Bottom 1.27: v61.59,17.09 63.5,19 76.88,19 77,19 81,23 81,31 v81,48
  pour Bottom (no thermals): 76.5,16.5 76.5,11.88 75,11.88 75,11.62 79,11.62 79,13 77.25,13 77.25,16.5
VDD_AUD3V3
  Top 0.254: C22.1 U3.16 U3.17 | 51.65,38.75 U3.25 | U3.24 49,39.75 49.5,40.25 C19.1
  Top 0.406: C18.1 51.65,38.75 C17.1 FB1.2 51.5,41.65 C19.1
  Top 0.61: C22.1 C21.1 C20.1 C19.1

### Text on the board
tPlace: Max Thrun - Jun 2013
bPlace: Beagle Boy v1.0 | DGND | SCL | SDA | DGND | 5V | 3V3 | DGND | - | + | JOY_X | JOY_Y | ADC_GND | VADC